# EAGLE design NixieClock_68k (EAGLE 9.2.1)

## Sheet 1 of 3: CPU, RAM, ROM
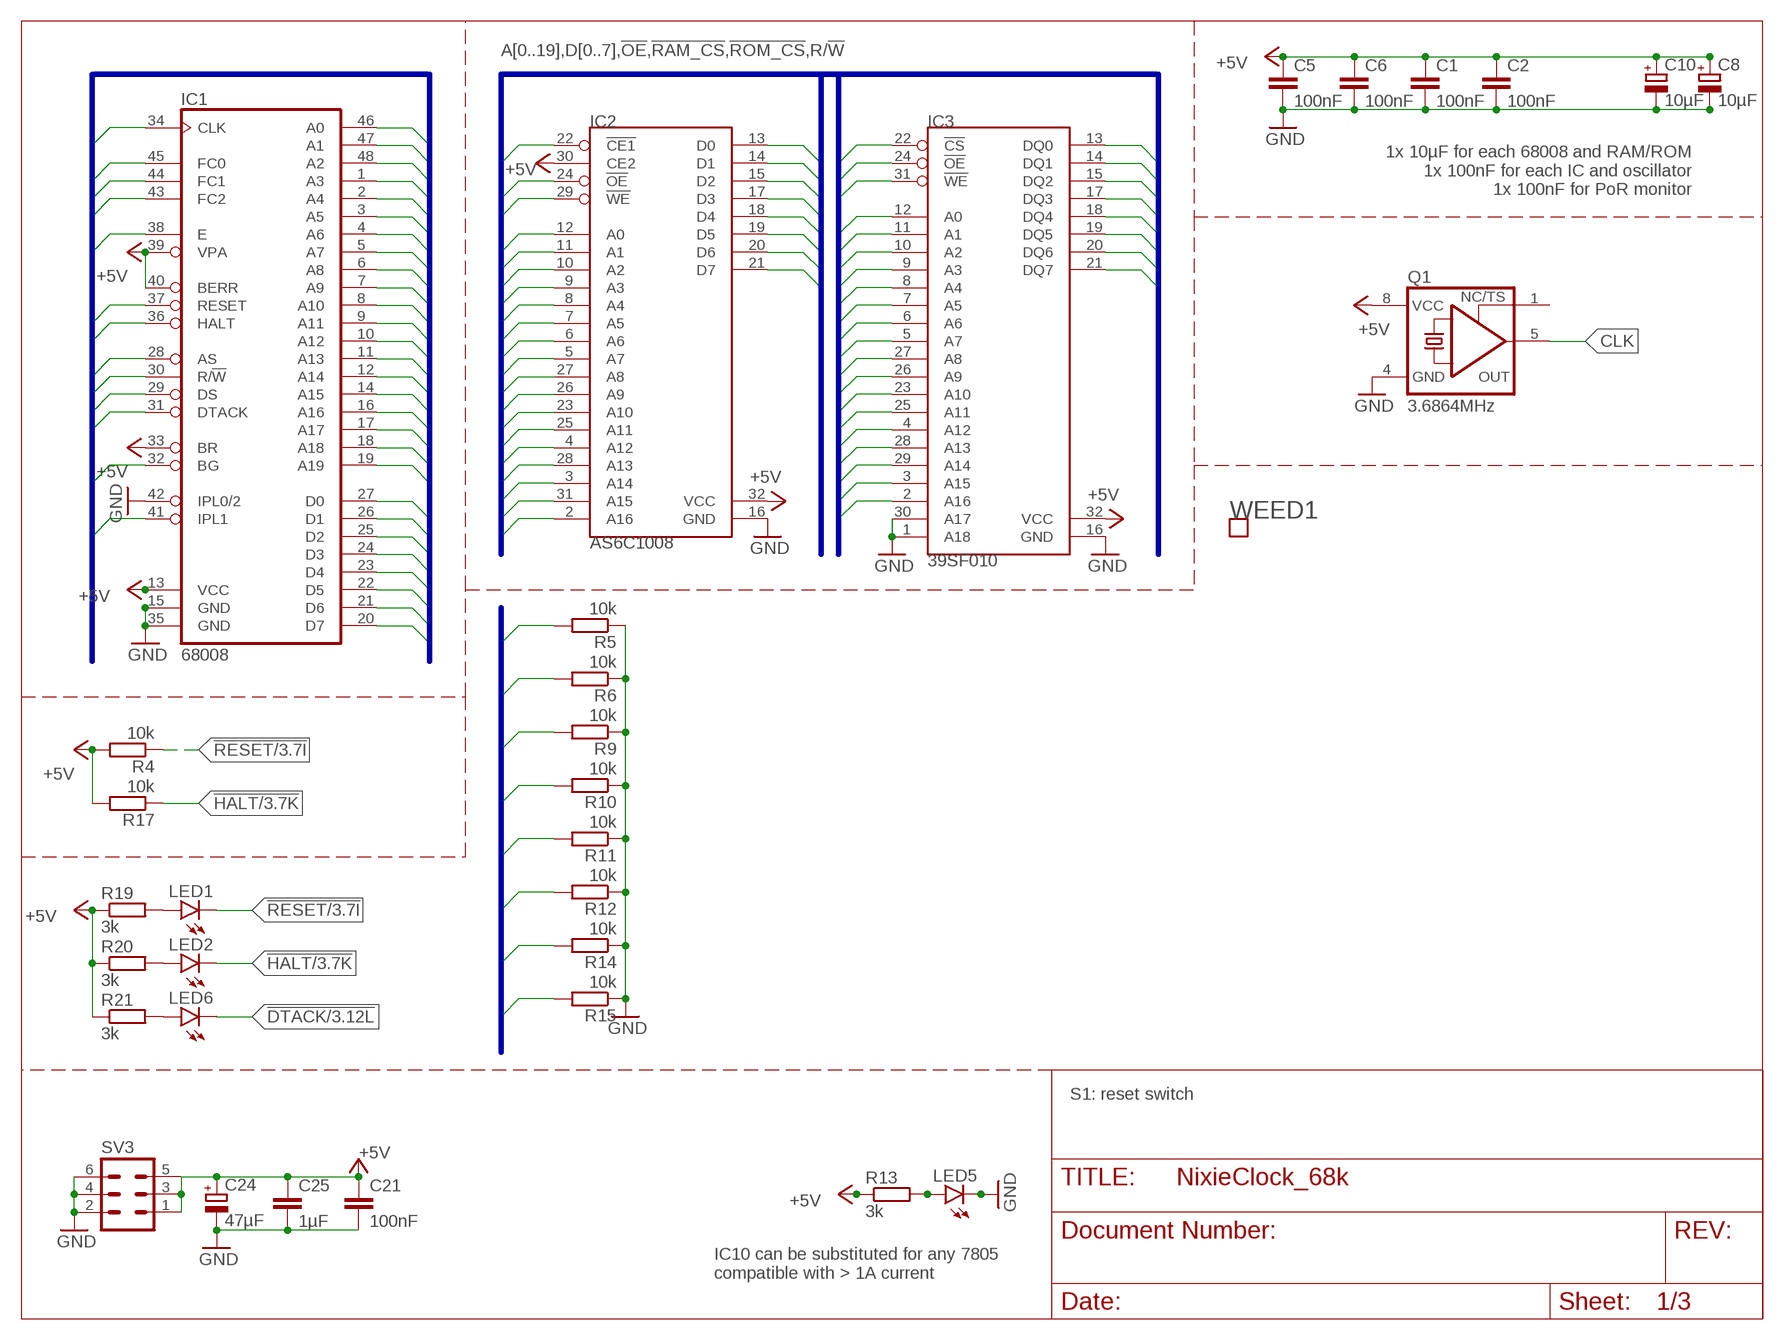
[diagram p0: schematic, sheet 1]

### Parts
C1  100nF  C-EUC0805  [C0805]
C2  100nF  C-EUC0805  [C0805]
C5  100nF  C-EUC0805  [C0805]
C6  100nF  C-EUC0805  [C0805]
C8  10µF  CPOL-EUSMCB  [SMC_B]
C10  10µF  CPOL-EUSMCB  [SMC_B]
C21  100nF  C-EUC0805  [C0805]
C24  47µF  CPOL-EUCT6032  [CT6032]
C25  1µF  C-EUC0805  [C0805]
IC1  68008  MC68008P  [DIL48]
IC2  AS6C1008  [DIL32]
IC3  39SF010  SST39SF0X0PDIP32  [DIL32]
LED1  LEDCHIPLED_1206  [CHIPLED_1206]
LED2  LEDCHIPLED_1206  [CHIPLED_1206]
LED5  LEDCHIPLED_1206  [CHIPLED_1206]
LED6  LEDCHIPLED_1206  [CHIPLED_1206]
Q1  3.6864MHz  XO-8  [DIL08S]
R4  10k  R-EU_R2012  [R2012]
R5  10k  R-EU_R2012  [R2012]
R6  10k  R-EU_R2012  [R2012]
R9  10k  R-EU_R2012  [R2012]
R10  10k  R-EU_R2012  [R2012]
R11  10k  R-EU_R2012  [R2012]
R12  10k  R-EU_R2012  [R2012]
R13  3k  R-EU_R2012  [R2012]
R14  10k  R-EU_R2012  [R2012]
R15  10k  R-EU_R2012  [R2012]
R17  10k  R-EU_R2012  [R2012]
R19  3k  R-EU_R2012  [R2012]
R20  3k  R-EU_R2012  [R2012]
R21  3k  R-EU_R2012  [R2012]
SV3  MA03-2  [MA03-2]
WEED1  WEED  [DOINK]

### Nets
!AS: IC1.28(AS) ; also sheet 3
!BG: IC1.32(BG)
!DS: IC1.29(DS)
!DTACK: IC1.31(DTACK) LED6.C ; also sheet 3
!HALT: IC1.36(HALT) LED2.C R17.1 ; also sheet 3
!IPL1: IC1.41(IPL1) ; also sheet 2
!OE: IC2.24(!OE) IC3.24(!OE) ; also sheet 2,3
!RAM_CS: IC2.22(!CE1) ; also sheet 3
!RESET: IC1.37(RESET) LED1.C R4.1 ; also sheet 2,3
!ROM_CS: IC3.22(!CS) ; also sheet 3
+5V: C1.1 C2.1 C5.1 C6.1 C8.+ C10.+ C21.1 C24.+ C25.1 IC1.13(VCC) IC1.33(BR) IC1.39(VPA) IC1.40(BERR) IC2.30(CE2) IC2.32(VCC) IC3.32(VCC) Q1.8(VCC) R4.2 R13.1 R17.2 R19.1 R20.1 R21.1 SV3.1 SV3.3 SV3.5 ; also sheet 2,3
A0: IC1.46(A0) IC2.12(A0) IC3.12(A0) ; also sheet 2
A1: IC1.47(A1) IC2.11(A1) IC3.11(A1) ; also sheet 2
A2: IC1.48(A2) IC2.10(A2) IC3.10(A2) ; also sheet 2
A3: IC1.1(A3) IC2.9(A3) IC3.9(A3) ; also sheet 2
A4: IC1.2(A4) IC2.8(A4) IC3.8(A4) ; also sheet 2
A5: IC1.3(A5) IC2.7(A5) IC3.7(A5) ; also sheet 2
A6: IC1.4(A6) IC2.6(A6) IC3.6(A6) ; also sheet 2
A7: IC1.5(A7) IC2.5(A7) IC3.5(A7) ; also sheet 2
A8: IC1.6(A8) IC2.27(A8) IC3.27(A8) ; also sheet 2
A9: IC1.7(A9) IC2.26(A9) IC3.26(A9) ; also sheet 2
A10: IC1.8(A10) IC2.23(A10) IC3.23(A10) ; also sheet 2
A11: IC1.9(A11) IC2.25(A11) IC3.25(A11) ; also sheet 2
A12: IC1.10(A12) IC2.4(A12) IC3.4(A12) ; also sheet 2
A13: IC1.11(A13) IC2.28(A13) IC3.28(A13) ; also sheet 2
A14: IC1.12(A14) IC2.3(A14) IC3.29(A14) ; also sheet 2
A15: IC1.14(A15) IC2.31(A15) IC3.3(A15)
A16: IC1.16(A16) IC2.2(A16) IC3.2(A16) ; also sheet 3
A17: IC1.17(A17) ; also sheet 3
A18: IC1.18(A18) ; also sheet 3
A19: IC1.19(A19)
CLK: IC1.34(CLK) Q1.5(OUT) ; also sheet 2
D0: IC1.27(D0) IC2.13(D0) IC3.13(DQ0) R5.2 ; also sheet 2
D1: IC1.26(D1) IC2.14(D1) IC3.14(DQ1) R6.2 ; also sheet 2
D2: IC1.25(D2) IC2.15(D2) IC3.15(DQ2) R9.2 ; also sheet 2
D3: IC1.24(D3) IC2.17(D3) IC3.17(DQ3) R10.2 ; also sheet 2
D4: IC1.23(D4) IC2.18(D4) IC3.18(DQ4) R11.2 ; also sheet 2
D5: IC1.22(D5) IC2.19(D5) IC3.19(DQ5) R12.2 ; also sheet 2
D6: IC1.21(D6) IC2.20(D6) IC3.20(DQ6) R14.2 ; also sheet 2
D7: IC1.20(D7) IC2.21(D7) IC3.21(DQ7) R15.2 ; also sheet 2
E: IC1.38(E)
FC0: IC1.45(FC0) ; also sheet 3
FC1: IC1.44(FC1) ; also sheet 3
FC2: IC1.43(FC2) ; also sheet 3
GND: C1.2 C2.2 C5.2 C6.2 C8.- C10.- C21.2 C24.- C25.2 IC1.15(GND) IC1.35(GND) IC1.42(IPL0/2) IC2.16(GND) IC3.1(A18) IC3.16(GND) IC3.30(A17) LED5.C Q1.4(GND) R5.1 R6.1 R9.1 R10.1 R11.1 R12.1 R14.1 R15.1 SV3.2 SV3.4 SV3.6 ; also sheet 2,3
N$2: LED1.A R19.2
N$4: LED5.A R13.2
N$6: LED2.A R20.2
N$10: LED6.A R21.2
R/!W!: IC1.30(R/!W) IC2.29(!WE) IC3.31(!WE) ; also sheet 2,3
Unconnected: Q1.1(TS)

### Buses
A[0..19],!AS,!BERR,!BG,!BR,CLK,D[0..7],!DS,!DTACK,E,FC[0..2],!HALT,!IPL0/2,!IPL1,!RESET,R/!W!,!VPA
A[0..19],D[0..7],!OE,!RAM_CS,!ROM_CS,R/!W!
D[0..7]

### Notes on the sheet
- 1x 10µF for each 68008 and RAM/ROM
  1x 100nF for each IC and oscillator
  1x 100nF for PoR monitor
- S1: reset switch
- IC10 can be substituted for any 7805 
  compatible with > 1A current

## Sheet 2 of 3: UART, RTC, Output Connectors
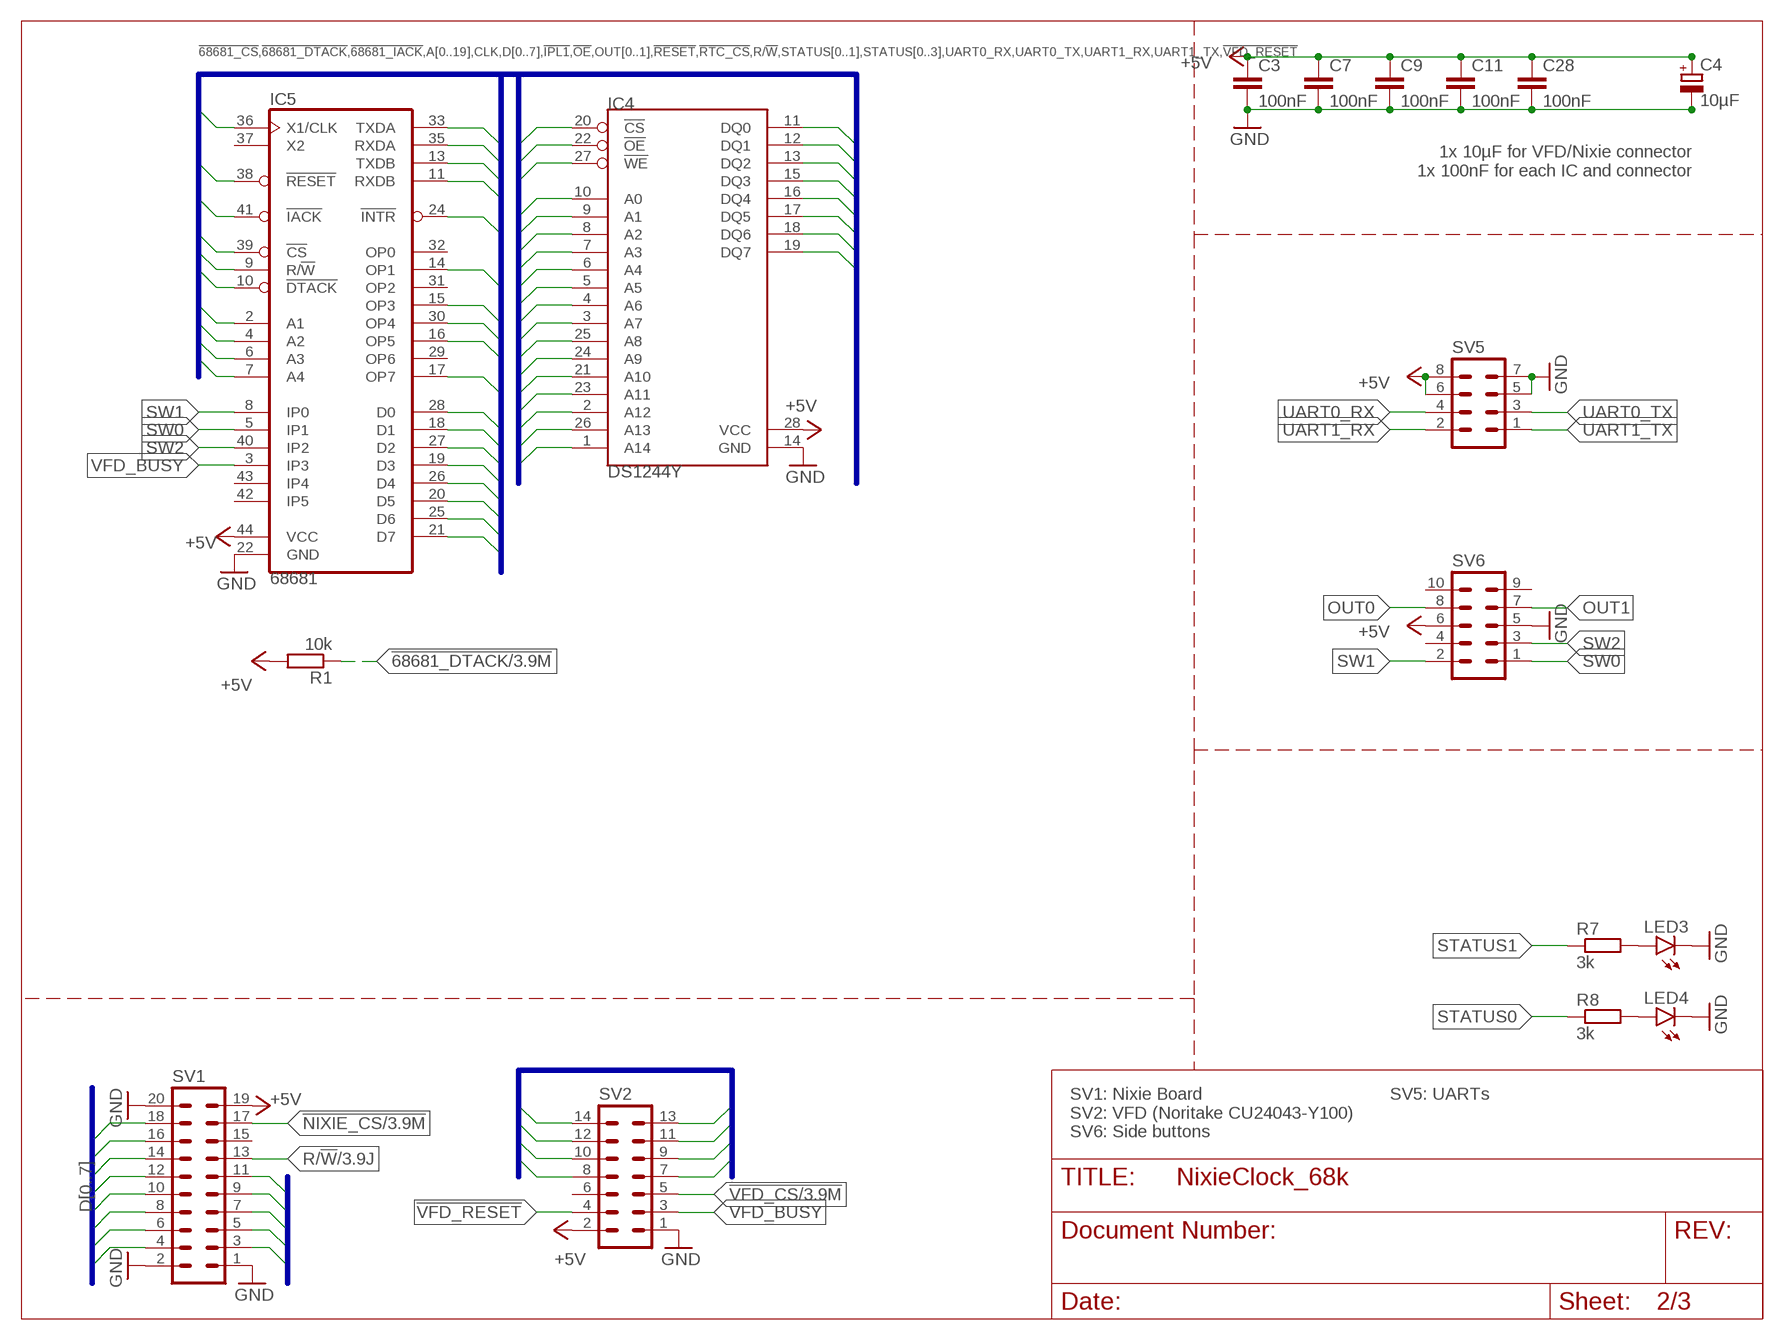
[diagram p1: schematic, sheet 2]

### Parts
C3  100nF  C-EUC0805  [C0805]
C4  10µF  CPOL-EUSMCB  [SMC_B]
C7  100nF  C-EUC0805  [C0805]
C9  100nF  C-EUC0805  [C0805]
C11  100nF  C-EUC0805  [C0805]
C28  100nF  C-EUC0805  [C0805]
IC4  DS1244Y  DS1244EDIP-28  [DIL28-6]
IC5  68681  MC68681PLCC44-SOCKET  [PLCC-S44]
LED3  LEDCHIPLED_1206  [CHIPLED_1206]
LED4  LEDCHIPLED_1206  [CHIPLED_1206]
R1  10k  R-EU_R2012  [R2012]
R7  3k  R-EU_R2012  [R2012]
R8  3k  R-EU_R2012  [R2012]
SV1  MA10-2  [MA10-2]
SV2  MA07-2  [MA07-2]
SV5  MA04-2  [MA04-2]
SV6  MA05-2  [MA05-2]

### Nets
!68681_CS: IC5.39(!CS) ; also sheet 3
!68681_DTACK: IC5.10(!DTACK) R1.1 ; also sheet 3
!68681_IACK: IC5.41(!IACK) ; also sheet 3
!IPL1: IC5.24(!INTR) ; also sheet 1
!NIXIE_CS: SV1.17 ; also sheet 3
!OE: IC4.22(!OE) ; also sheet 1,3
!RESET: IC5.38(!RESET) ; also sheet 1,3
!RTC_CS: IC4.20(!CS) ; also sheet 3
!VFD_CS: SV2.5 ; also sheet 3
!VFD_RESET: IC5.30(OP4) SV2.4
+5V: C3.1 C4.+ C7.1 C9.1 C11.1 C28.1 IC4.28(VCC) IC5.44(VCC) R1.2 SV1.19 SV2.2 SV5.6 SV5.8 SV6.6 ; also sheet 1,3
A0: IC4.10(A0) IC5.2(A1) SV1.3 ; also sheet 1
A1: IC4.9(A1) IC5.4(A2) SV1.5 ; also sheet 1
A2: IC4.8(A2) IC5.6(A3) SV1.7 ; also sheet 1
A3: IC4.7(A3) IC5.7(A4) SV1.9 ; also sheet 1
A4: IC4.6(A4) SV1.11 ; also sheet 1
A5: IC4.5(A5) ; also sheet 1
A6: IC4.4(A6) ; also sheet 1
A7: IC4.3(A7) ; also sheet 1
A8: IC4.25(A8) ; also sheet 1
A9: IC4.24(A9) ; also sheet 1
A10: IC4.21(A10) ; also sheet 1
A11: IC4.23(A11) ; also sheet 1
A12: IC4.2(A12) ; also sheet 1
A13: IC4.26(A13) ; also sheet 1
A14: IC4.1(A14) ; also sheet 1
CLK: IC5.36(X1/CLK) ; also sheet 1
D0: IC4.11(DQ0) IC5.28(D0) SV1.8 SV2.7 ; also sheet 1
D1: IC4.12(DQ1) IC5.18(D1) SV1.6 SV2.8 ; also sheet 1
D2: IC4.13(DQ2) IC5.27(D2) SV1.4 SV2.9 ; also sheet 1
D3: IC4.15(DQ3) IC5.19(D3) SV1.10 SV2.10 ; also sheet 1
D4: IC4.16(DQ4) IC5.26(D4) SV1.12 SV2.11 ; also sheet 1
D5: IC4.17(DQ5) IC5.20(D5) SV1.14 SV2.12 ; also sheet 1
D6: IC4.18(DQ6) IC5.25(D6) SV1.16 SV2.13 ; also sheet 1
D7: IC4.19(DQ7) IC5.21(D7) SV1.18 SV2.14 ; also sheet 1
GND: C3.2 C4.- C7.2 C9.2 C11.2 C28.2 IC4.14(GND) IC5.22(GND) LED3.C LED4.C SV1.1 SV1.2 SV1.20 SV2.1 SV5.5 SV5.7 SV6.5 ; also sheet 1,3
N$7: LED3.A R7.2
N$9: LED4.A R8.2
OUT0: IC5.15(OP3) SV6.8
OUT1: IC5.14(OP1) SV6.7
R/!W!: IC4.27(!WE) IC5.9(R/!W) SV1.13 ; also sheet 1,3
STATUS0: IC5.17(OP7) R8.1
STATUS1: IC5.16(OP5) R7.1
SW0: IC5.5(IP1) SV6.1
SW1: IC5.8(IP0) SV6.2
SW2: IC5.40(IP2) SV6.3
UART0_RX: IC5.35(RXDA) SV5.4
UART0_TX: IC5.33(TXDA) SV5.3
UART1_RX: IC5.11(RXDB) SV5.2
UART1_TX: IC5.13(TXDB) SV5.1
VFD_BUSY: IC5.3(IP3) SV2.3
Unconnected: IC5.29(OP6) IC5.31(OP2) IC5.32(OP0) IC5.37(X2) IC5.42(IP5) IC5.43(IP4) SV1.15 SV2.6 SV6.4 SV6.9 SV6.10

### Buses
!68681_CS,!68681_DTACK,!68681_IACK,A[0..19],CLK,D[0..7],!IPL1,!OE,OUT[0..1],!RESET,!RTC_CS,R/!W!,STATUS[0..1],STATUS[0..3],UART0_RX,UART0_TX,UART1_RX,UART1_TX,!VFD_RESET
D[0..7]
A[0..19]

### Notes on the sheet
- 1x 10µF for VFD/Nixie connector
  1x 100nF for each IC and connector
- SV1: Nixie Board
  SV2: VFD (Noritake CU24043-Y100)
  SV6: Side buttons
- SV5: UARTs

## Sheet 3 of 3: IRQs and Address Decoding
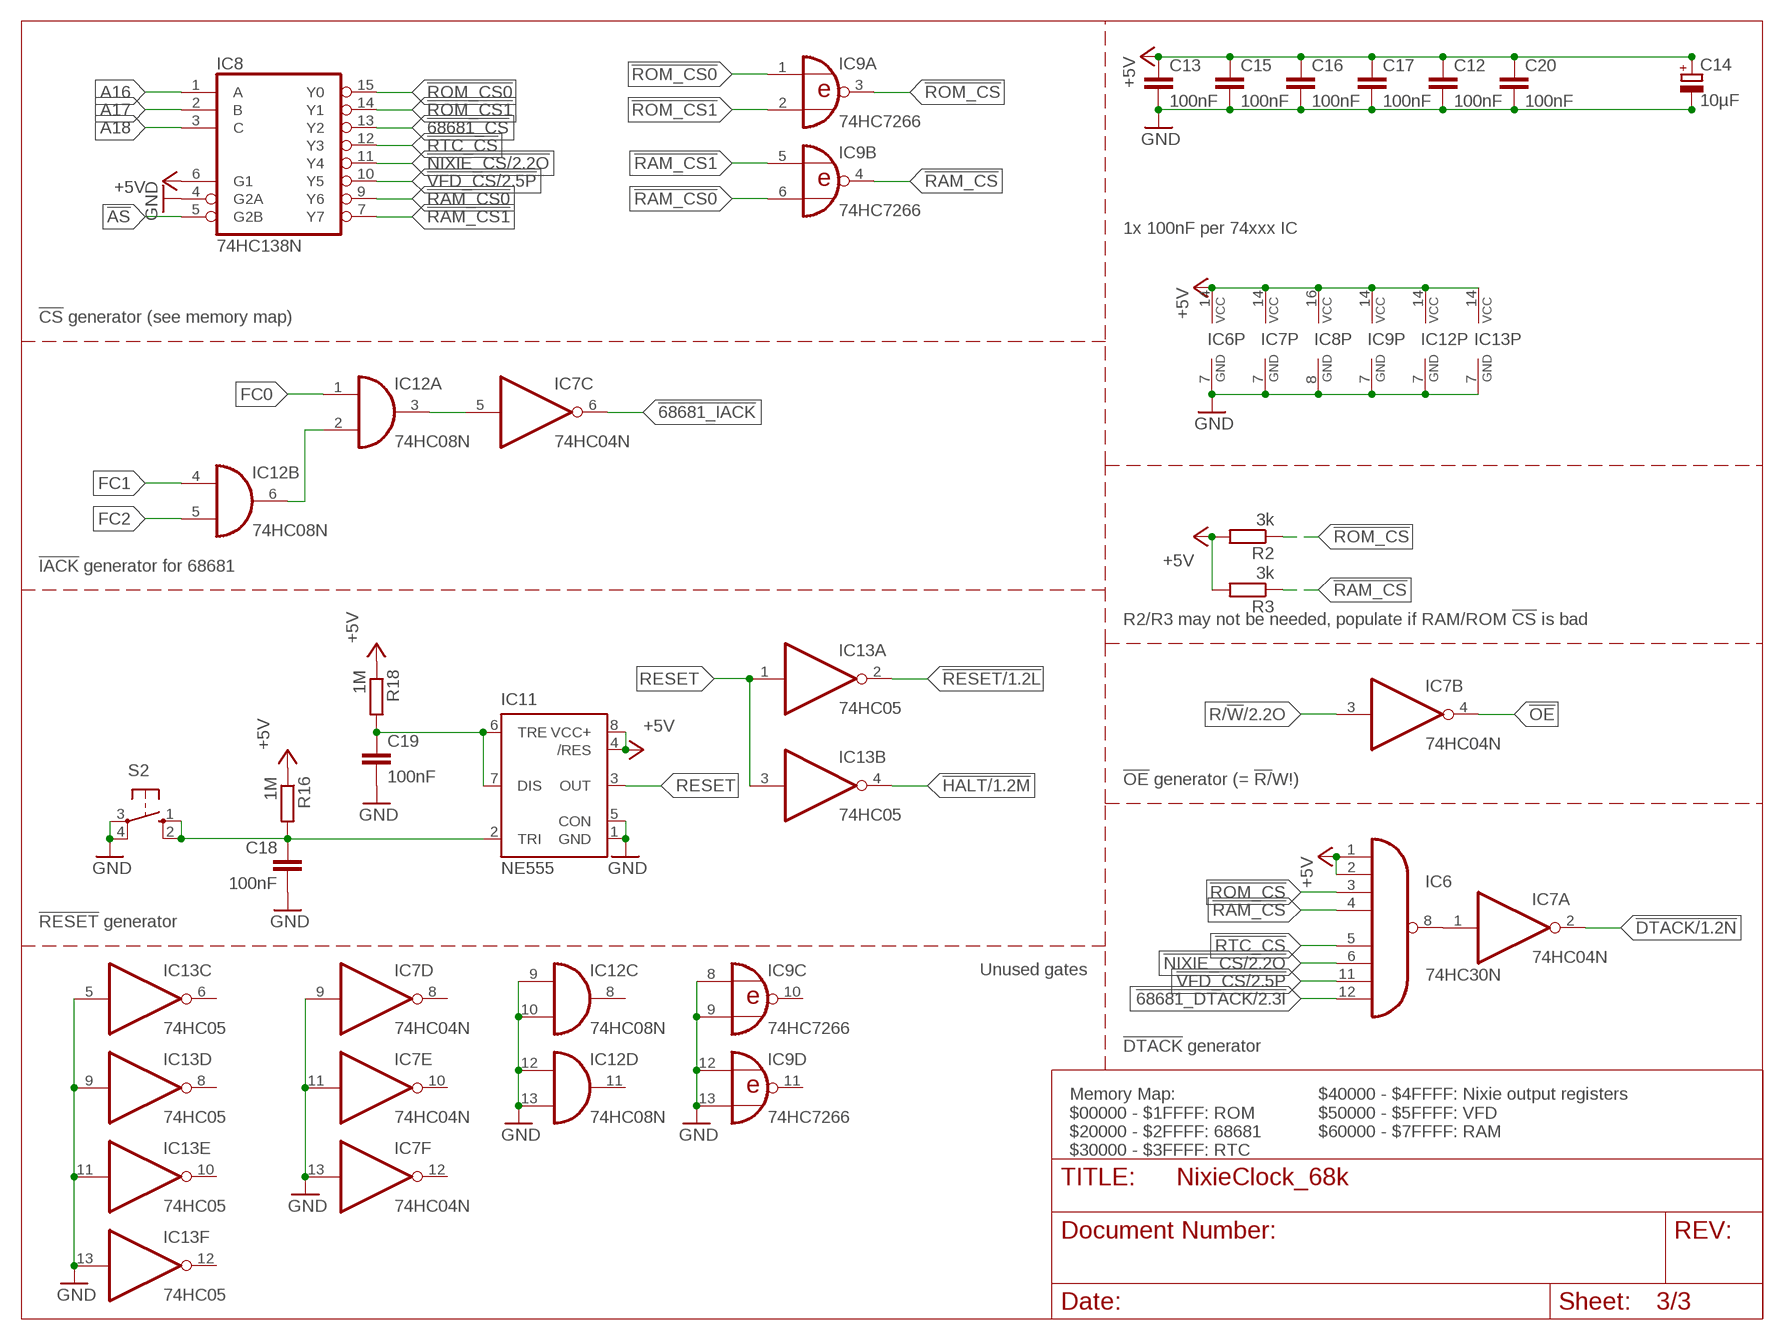
[diagram p2: schematic, sheet 3]

### Parts
C12  100nF  C-EUC0805  [C0805]
C13  100nF  C-EUC0805  [C0805]
C14  10µF  CPOL-EUSMCB  [SMC_B]
C15  100nF  C-EUC0805  [C0805]
C16  100nF  C-EUC0805  [C0805]
C17  100nF  C-EUC0805  [C0805]
C18  100nF  C-EUC0805  [C0805]
C19  100nF  C-EUC0805  [C0805]
C20  100nF  C-EUC0805  [C0805]
IC6  74HC30N  [DIL14]
IC7  74HC04N  [DIL14]
IC8  74HC138N  [DIL16]
IC9  74HC7266  74HC266N  [DIL14]
IC11  NE555  [DIL-08]
IC12  74HC08N  [DIL14]
IC13  74HC05  74HCT05N  [DIL14]
R2  3k  R-EU_R2012  [R2012]
R3  3k  R-EU_R2012  [R2012]
R16  1M  R-EU_R2012  [R2012]
R18  1M  R-EU_R2012  [R2012]
S2  10-XX  [B3F-10XX]

### Nets
!68681_CS: IC8.13(Y2) ; also sheet 2
!68681_DTACK: IC6.12(I7) ; also sheet 2
!68681_IACK: IC7.6(C:O) ; also sheet 2
!AS: IC8.5(G2B) ; also sheet 1
!DTACK: IC7.2(A:O) ; also sheet 1
!HALT: IC13.4(B:O) ; also sheet 1
!NIXIE_CS: IC6.6(I5) IC8.11(Y4) ; also sheet 2
!OE: IC7.4(B:O) ; also sheet 1,2
!RAM_CS: IC6.4(I3) IC9.4(B:O) R3.1 ; also sheet 1
!RAM_CS0: IC8.9(Y6) IC9.6(B:I1)
!RAM_CS1: IC8.7(Y7) IC9.5(B:I0)
!RESET: IC13.2(A:O) ; also sheet 1,2
!ROM_CS: IC6.3(I2) IC9.3(A:O) R2.1 ; also sheet 1
!ROM_CS0: IC8.15(Y0) IC9.1(A:I0)
!ROM_CS1: IC8.14(Y1) IC9.2(A:I1)
!RTC_CS: IC6.5(I4) IC8.12(Y3) ; also sheet 2
!VFD_CS: IC6.11(I6) IC8.10(Y5) ; also sheet 2
+5V: C12.1 C13.1 C14.+ C15.1 C16.1 C17.1 C20.1 IC6.1(I0) IC6.2(I1) IC6.14(VCC) IC7.14(P:VCC) IC8.6(G1) IC8.16(VCC) IC9.14(P:VCC) IC11.4(/RES) IC11.8(VCC+) IC12.14(P:VCC) IC13.14(P:VCC) R2.2 R3.2 R16.1 R18.1 ; also sheet 1,2
A16: IC8.1(A) ; also sheet 1
A17: IC8.2(B) ; also sheet 1
A18: IC8.3(C) ; also sheet 1
FC0: IC12.1(A:I0) ; also sheet 1
FC1: IC12.4(B:I0) ; also sheet 1
FC2: IC12.5(B:I1) ; also sheet 1
GND: C12.2 C13.2 C14.- C15.2 C16.2 C17.2 C18.2 C19.2 C20.2 IC6.7(GND) IC7.7(P:GND) IC7.9(D:I) IC7.11(E:I) IC7.13(F:I) IC8.4(G2A) IC8.8(GND) IC9.7(P:GND) IC9.8(C:I0) IC9.9(C:I1) IC9.12(D:I0) IC9.13(D:I1) IC11.1(GND) IC11.5(CON) IC12.7(P:GND) IC12.9(C:I0) IC12.10(C:I1) IC12.12(D:I0) IC12.13(D:I1) IC13.5(C:I) IC13.7(P:GND) IC13.9(D:I) IC13.11(E:I) IC13.13(F:I) S2.3(P) S2.4(P1) ; also sheet 1,2
N$1: C18.1 IC11.2(TRI) R16.2 S2.1(S) S2.2(S1)
N$3: IC6.8(O) IC7.1(A:I)
N$5: IC7.5(C:I) IC12.3(A:O)
N$11: IC12.2(A:I1) IC12.6(B:O)
N$12: C19.1 IC11.6(TRE) IC11.7(DIS) R18.2
R/!W!: IC7.3(B:I) ; also sheet 1,2
RESET: IC11.3(OUT) IC13.1(A:I) IC13.3(B:I)
Unconnected: IC7.8(D:O) IC7.10(E:O) IC7.12(F:O) IC9.10(C:O) IC9.11(D:O) IC12.8(C:O) IC12.11(D:O) IC13.6(C:O) IC13.8(D:O) IC13.10(E:O) IC13.12(F:O)

### Notes on the sheet
- 1x 100nF per 74xxx IC
- !CS! generator (see memory map)
- !IACK! generator for 68681
- R2/R3 may not be needed, populate if RAM/ROM !CS! is bad
- !OE! generator (= !R/!W!)
- !RESET! generator
- Unused gates
- !DTACK! generator
- Memory Map:
  $00000 - $1FFFF: ROM
  $20000 - $2FFFF: 68681
  $30000 - $3FFFF: RTC
- $40000 - $4FFFF: Nixie output registers
  $50000 - $5FFFF: VFD
  $60000 - $7FFFF: RAM

## Library data of the parts
C1-C3 C5-C7 C9 C11-C13 C15-C18 C20 C21 C28 = rcl:C-EU: CAPACITOR, European symbol; MOUSER: 710-885012207072; SPICEPREFIX: C
C4 C8 C10 C14 = rcl:CPOL-EU: POLARIZED CAPACITOR, European symbol; MOUSER: 581-TAJB106K020RNJV; SPICEPREFIX: C
C19 = rcl:C-EU: CAPACITOR, European symbol; MOUSER: 710-885012207078; SPICEPREFIX: C
C24 = rcl:CPOL-EU: POLARIZED CAPACITOR, European symbol; MOUSER: 581-TAJD476M016RNJV; SPICEPREFIX: C
C25 = rcl:C-EU: CAPACITOR, European symbol; MOUSER: 710-885012107015; SPICEPREFIX: C
IC1 = Parts:MC68008P: 68008 Processor (68000 with 8-bit bus)
IC2 = Parts:AS6C1008: AS6C1008 – 128K x 8 Low Power SRAM Datasheet <https://www.mouser.com/datasheet/2/12/AS6C1008feb2007-1511508.pdf>; MOUSER: 913-AS6C1008-55PCN
IC3 = Parts:SST39SF0X0: 1 Mbit / 2 Mbit / 4 Mbit Multi-Purpose Flash Datasheet <http://ww1.microchip.com/downloads/en/DeviceDoc/20005022C.pdf>; MOUSER: 804-39SF010A7CPHE
IC4 = Parts:DS1244: 256k NV SRAM with Phantom Clock Datasheet <https://datasheets.maximintegrated.com/en/ds/DS1244-DS1244P.pdf>; MOUSER: 700-DS1244Y-70
IC5 = Parts:MC68681: MC68681 Dual UART Datasheet <https://www.nxp.com/docs/en/data-sheet/SCC68681.pdf>
IC6 = 74xx-eu:74*30: 8-input NAND gate; MOUSER: 595-CD74HC30E
IC7 = 74xx-eu:74*04: Hex INVERTER; MOUSER: 595-SN74HC04AN
IC8 = 74xx-eu:74*138: 3-line to 8-line DECODER/DEMULTIPLEXER; MOUSER: 595-SN74HC138N
IC9 = 74xx-eu:74*266: Quadruple EXCLUSIVE-NOR (XNOR), open-collector; MOUSER: 595-CD74HC7266E
IC11 = st-microelectronics:NE555: General purpose bipolar Timer; MF: Arrow Electronics; MOUSER: 595-NE555P; MPN: NE555N; OC_FARNELL: 1467742; OC_NEWARK: 89K1486
IC12 = 74xx-eu:74*08: Quad 2-input AND gate; MOUSER: 595-SN74HC08AN
IC13 = 74xx-eu:74*05: Hex INVERTER, open collector; MOUSER: 595-SN74HC05N
LED1 LED2 = led:LED: LED OSRAM: - CHIPLED LG R971, LG N971, LY N971, LG Q971, LY Q971, LO R971, LY R971 LH N974, LH R974 LS Q976, LO Q976, LY Q976 LO Q996 - Hyper CHIPLED LW Q18S LB Q993, LB Q99A, LB R99A - SideLED LS A670, LO A670, LY A670, LG A670, LP A670 LB A673, LV A673, LT A673, LW A673 LH A674 LY A675 LS A676, LA A676, LO A676, LY A676, LW A676 LS A679, LY A679, LG A679 - Hyper Micro SIDELED® LS Y876, LA Y876, LO Y876, LY Y876 LT Y87S - SmartLED LW L88C, LW L88S LB L89C, LB L89S, LG L890 LS L89K, LO L89K, LY L89K LS L896, LA L896, LO L896, LY L896 - TOPLED LS T670, LO T670, LY T670, LG T670, LP T670 LSG T670, LSP T670, LSY T670, LOP T670, LYG T670 LG T671, LOG T671, LSG T671 LB T673, LV T673, LT T673, LW T673 LH T674 LS T676, LA T676, LO T676, LY T676, LB T676, LH T676, LSB T676, LW T676 LB T67C, LV T67C, LT T67C, LS T67K, LO T67K, LY T67K, LW E67C LS E67B, LA E67B, LO E67B, LY E67B, LB E67C, LV E67C, LT E67C LW T67C LS T679, LY T679, LG T679 LS T770, LO T770, LY T770, LG T770, LP T770 LB T773, LV T773, LT T773, LW T773 LH T774 LS E675, LA E675, LY E675, LS T675 LS T776, LA T776, LO T776, LY T776, LB T776 LHGB T686 LT T68C, LB T68C - Hyper Mini TOPLED® LB M676 - Mini TOPLED Santana® LG M470 LS M47K, LO M47K, LY M47K Source: http://www.osram.convergy.de LUXEON: - LUMILED® LXK2-PW12-R00, LXK2-PW12-S00, LXK2-PW14-U00, LXK2-PW14-V00 LXK2-PM12-R00, LXK2-PM12-S00, LXK2-PM14-U00 LXK2-PE12-Q00, LXK2-PE12-R00, LXK2-PE12-S00, LXK2-PE14-T00, LXK2-PE14-U00 LXK2-PB12-K00, LXK2-PB12-L00, LXK2-PB12-M00, LXK2-PB14-N00, LXK2-PB14-P00, LXK2-PB14-Q00 LXK2-PR12-L00, LXK2-PR12-M00, LXK2-PR14-Q00, LXK2-PR14-R00 LXK2-PD12-Q00, LXK2-PD12-R00, LXK2-PD12-S00 LXK2-PH12-R00, LXK2-PH12-S00 LXK2-PL12-P00, LXK2-PL12-Q00, LXK2-PL12-R00 Source: www.luxeon.com KINGBRIGHT: KA-3528ASYC Source: www.kingbright.com; MOUSER: 710-156120RS75300
LED3 LED4 LED6 = led:LED: LED OSRAM: - CHIPLED LG R971, LG N971, LY N971, LG Q971, LY Q971, LO R971, LY R971 LH N974, LH R974 LS Q976, LO Q976, LY Q976 LO Q996 - Hyper CHIPLED LW Q18S LB Q993, LB Q99A, LB R99A - SideLED LS A670, LO A670, LY A670, LG A670, LP A670 LB A673, LV A673, LT A673, LW A673 LH A674 LY A675 LS A676, LA A676, LO A676, LY A676, LW A676 LS A679, LY A679, LG A679 - Hyper Micro SIDELED® LS Y876, LA Y876, LO Y876, LY Y876 LT Y87S - SmartLED LW L88C, LW L88S LB L89C, LB L89S, LG L890 LS L89K, LO L89K, LY L89K LS L896, LA L896, LO L896, LY L896 - TOPLED LS T670, LO T670, LY T670, LG T670, LP T670 LSG T670, LSP T670, LSY T670, LOP T670, LYG T670 LG T671, LOG T671, LSG T671 LB T673, LV T673, LT T673, LW T673 LH T674 LS T676, LA T676, LO T676, LY T676, LB T676, LH T676, LSB T676, LW T676 LB T67C, LV T67C, LT T67C, LS T67K, LO T67K, LY T67K, LW E67C LS E67B, LA E67B, LO E67B, LY E67B, LB E67C, LV E67C, LT E67C LW T67C LS T679, LY T679, LG T679 LS T770, LO T770, LY T770, LG T770, LP T770 LB T773, LV T773, LT T773, LW T773 LH T774 LS E675, LA E675, LY E675, LS T675 LS T776, LA T776, LO T776, LY T776, LB T776 LHGB T686 LT T68C, LB T68C - Hyper Mini TOPLED® LB M676 - Mini TOPLED Santana® LG M470 LS M47K, LO M47K, LY M47K Source: http://www.osram.convergy.de LUXEON: - LUMILED® LXK2-PW12-R00, LXK2-PW12-S00, LXK2-PW14-U00, LXK2-PW14-V00 LXK2-PM12-R00, LXK2-PM12-S00, LXK2-PM14-U00 LXK2-PE12-Q00, LXK2-PE12-R00, LXK2-PE12-S00, LXK2-PE14-T00, LXK2-PE14-U00 LXK2-PB12-K00, LXK2-PB12-L00, LXK2-PB12-M00, LXK2-PB14-N00, LXK2-PB14-P00, LXK2-PB14-Q00 LXK2-PR12-L00, LXK2-PR12-M00, LXK2-PR14-Q00, LXK2-PR14-R00 LXK2-PD12-Q00, LXK2-PD12-R00, LXK2-PD12-S00 LXK2-PH12-R00, LXK2-PH12-S00 LXK2-PL12-P00, LXK2-PL12-Q00, LXK2-PL12-R00 Source: www.luxeon.com KINGBRIGHT: KA-3528ASYC Source: www.kingbright.com; MOUSER: 710-156120VS75300
LED5 = led:LED: LED OSRAM: - CHIPLED LG R971, LG N971, LY N971, LG Q971, LY Q971, LO R971, LY R971 LH N974, LH R974 LS Q976, LO Q976, LY Q976 LO Q996 - Hyper CHIPLED LW Q18S LB Q993, LB Q99A, LB R99A - SideLED LS A670, LO A670, LY A670, LG A670, LP A670 LB A673, LV A673, LT A673, LW A673 LH A674 LY A675 LS A676, LA A676, LO A676, LY A676, LW A676 LS A679, LY A679, LG A679 - Hyper Micro SIDELED® LS Y876, LA Y876, LO Y876, LY Y876 LT Y87S - SmartLED LW L88C, LW L88S LB L89C, LB L89S, LG L890 LS L89K, LO L89K, LY L89K LS L896, LA L896, LO L896, LY L896 - TOPLED LS T670, LO T670, LY T670, LG T670, LP T670 LSG T670, LSP T670, LSY T670, LOP T670, LYG T670 LG T671, LOG T671, LSG T671 LB T673, LV T673, LT T673, LW T673 LH T674 LS T676, LA T676, LO T676, LY T676, LB T676, LH T676, LSB T676, LW T676 LB T67C, LV T67C, LT T67C, LS T67K, LO T67K, LY T67K, LW E67C LS E67B, LA E67B, LO E67B, LY E67B, LB E67C, LV E67C, LT E67C LW T67C LS T679, LY T679, LG T679 LS T770, LO T770, LY T770, LG T770, LP T770 LB T773, LV T773, LT T773, LW T773 LH T774 LS E675, LA E675, LY E675, LS T675 LS T776, LA T776, LO T776, LY T776, LB T776 LHGB T686 LT T68C, LB T68C - Hyper Mini TOPLED® LB M676 - Mini TOPLED Santana® LG M470 LS M47K, LO M47K, LY M47K Source: http://www.osram.convergy.de LUXEON: - LUMILED® LXK2-PW12-R00, LXK2-PW12-S00, LXK2-PW14-U00, LXK2-PW14-V00 LXK2-PM12-R00, LXK2-PM12-S00, LXK2-PM14-U00 LXK2-PE12-Q00, LXK2-PE12-R00, LXK2-PE12-S00, LXK2-PE14-T00, LXK2-PE14-U00 LXK2-PB12-K00, LXK2-PB12-L00, LXK2-PB12-M00, LXK2-PB14-N00, LXK2-PB14-P00, LXK2-PB14-Q00 LXK2-PR12-L00, LXK2-PR12-M00, LXK2-PR14-Q00, LXK2-PR14-R00 LXK2-PD12-Q00, LXK2-PD12-R00, LXK2-PD12-S00 LXK2-PH12-R00, LXK2-PH12-S00 LXK2-PL12-P00, LXK2-PL12-Q00, LXK2-PL12-R00 Source: www.luxeon.com KINGBRIGHT: KA-3528ASYC Source: www.kingbright.com; MOUSER: 710-156120YS75300
Q1 = crystal:XO-: CRYSTAL; MOUSER: 774-MXO45HS-3C-3.6; OC_FARNELL: unknown; OC_NEWARK: unknown
R1 R4-R6 R9-R12 R14 R15 R17 = rcl:R-EU_: RESISTOR, European symbol; MOUSER: 652-CR0805FX-1002ELF; SPICEPREFIX: R
R2 R3 R7 R8 R13 R19-R21 = rcl:R-EU_: RESISTOR, European symbol; MOUSER: 652-CR0805JW-302ELF; SPICEPREFIX: R
R16 R18 = rcl:R-EU_: RESISTOR, European symbol; MOUSER: 652-CR0805FX-18R2ELF; SPICEPREFIX: R
S2 = switch-omron:10-XX: OMRON SWITCH; MOUSER: 653-B3F-1052; MPN: B3F-1000; OC_FARNELL: 176432; OC_NEWARK: 36M3542
SV1 = con-lstb:MA10-2: PIN HEADER; OC_FARNELL: unknown; OC_NEWARK: unknown
SV2 = con-lstb:MA07-2: PIN HEADER; OC_FARNELL: unknown; OC_NEWARK: unknown
SV3 = con-lstb:MA03-2: PIN HEADER; OC_FARNELL: unknown; OC_NEWARK: unknown
SV5 = con-lstb:MA04-2: PIN HEADER; OC_FARNELL: unknown; OC_NEWARK: unknown
SV6 = con-lstb:MA05-2: PIN HEADER; OC_FARNELL: unknown; OC_NEWARK: unknown
WEED1 = Parts:WEED

## Net classes
0 default: width 0.203 mm

## Board
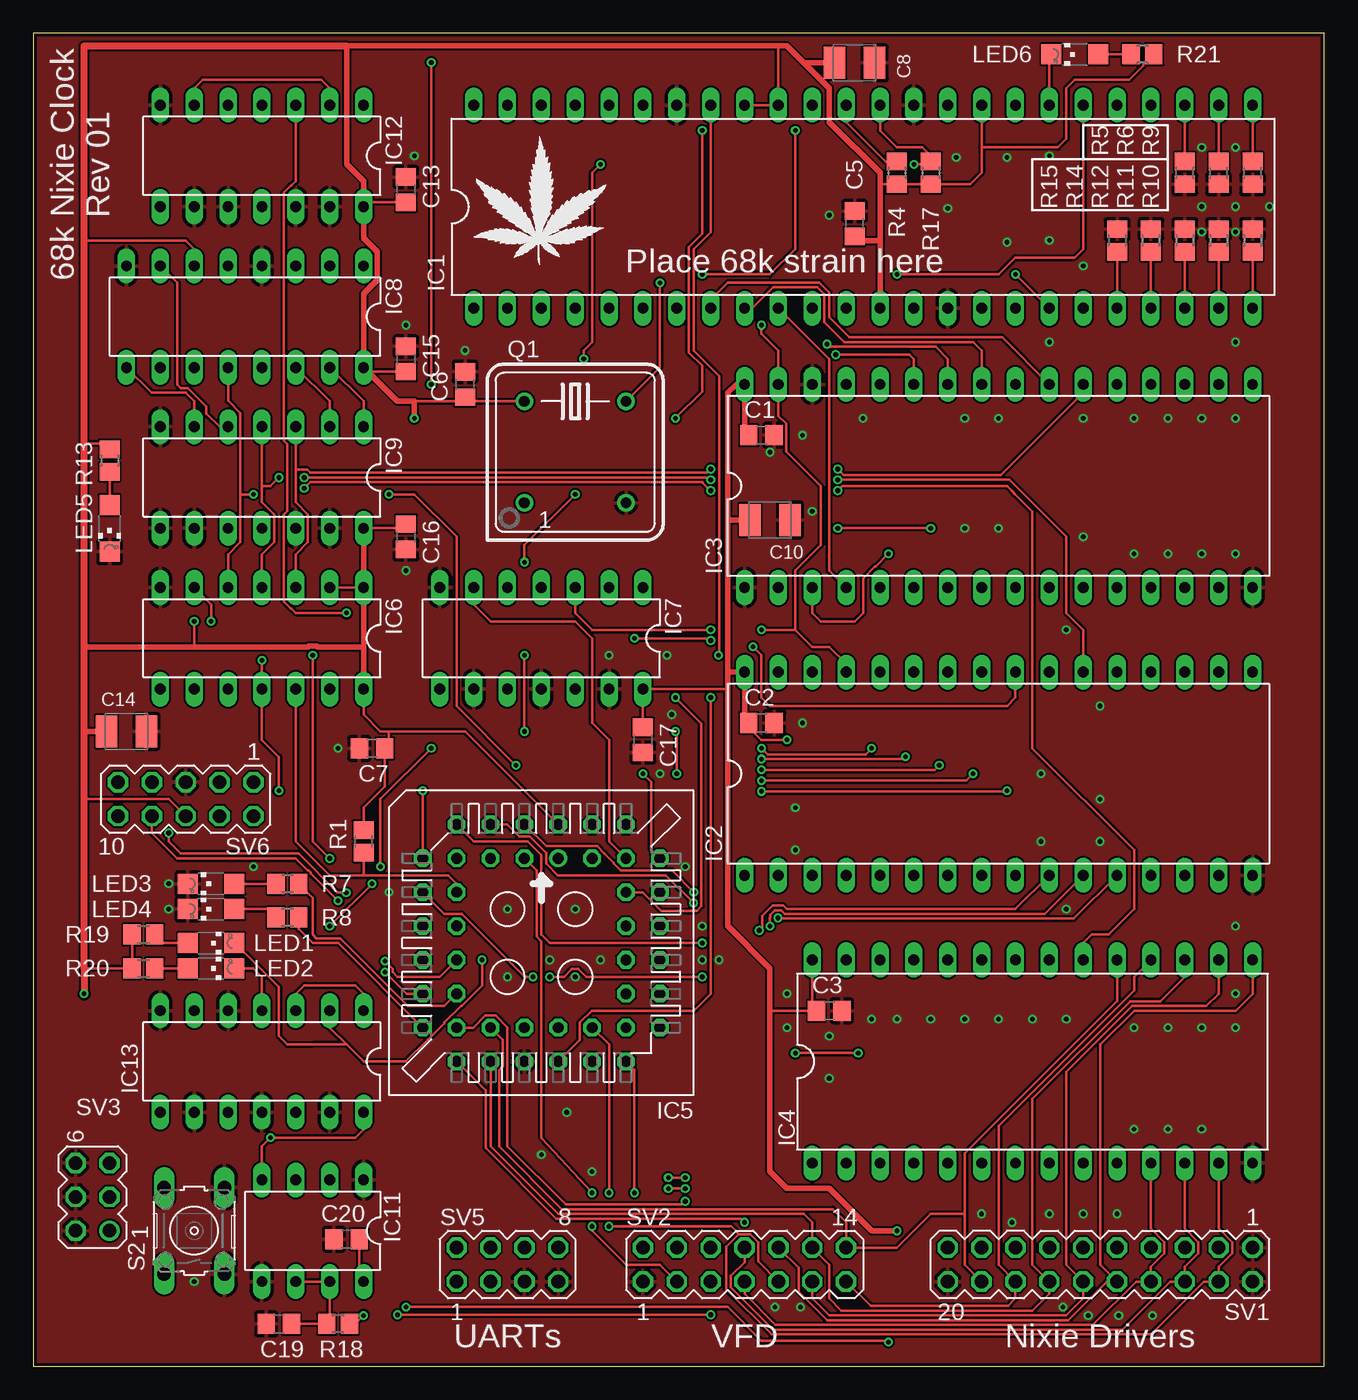
[diagram p3: board, top side]
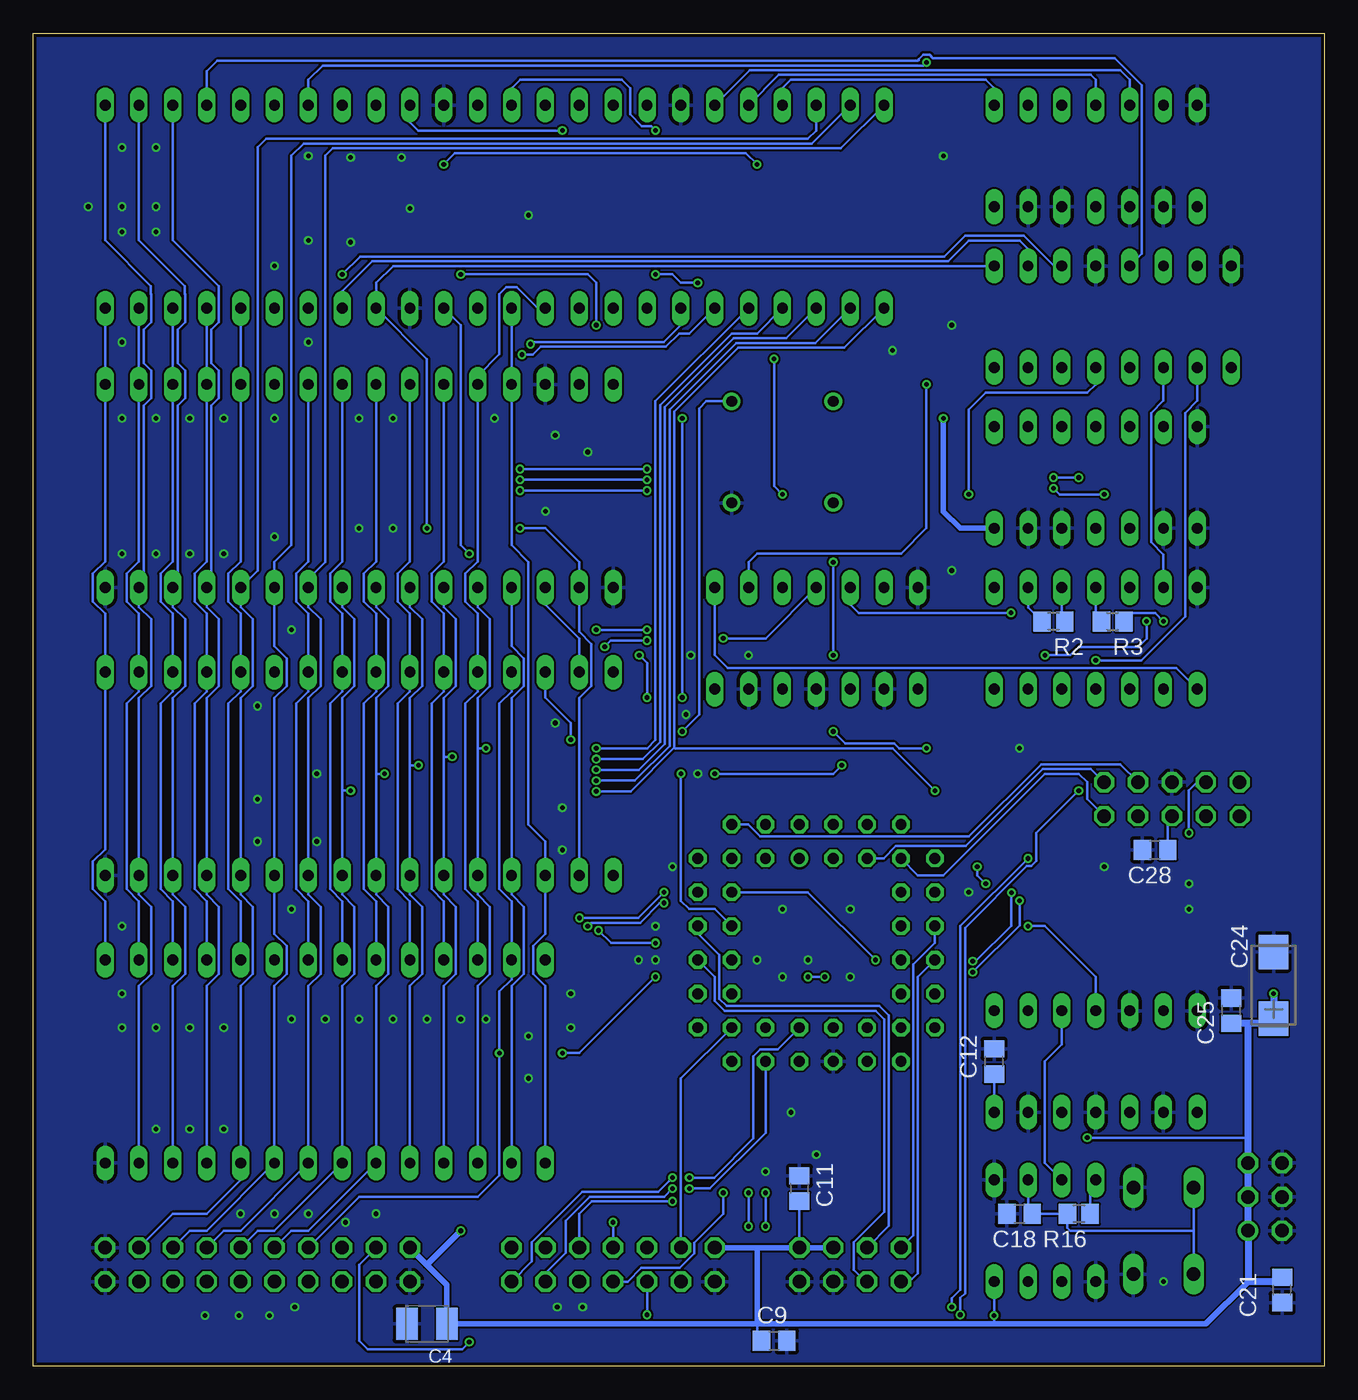
[diagram p4: board, bottom side, seen from below]

Size 96.83 x 100 mm. Coordinates in mm from the lower left corner, seen from the top.
Outline: 0,0 96.83,0 96.83,100 0,100 0,0
Copper layers (1*16): Top 0.035mm / dielectric 1.5mm / Bottom 0.035mm
Design rules "dirt_cheap_dirty_boards.v1.1": minimum track width 6mil, minimum drill 12mil, track to track 6mil, track to pad 6mil, pad to pad 6mil, via to via 6mil, smd to smd 0mil, copper to edge 10mil, drill to drill 10mil, minimum pad ring 10mil, minimum via ring 6mil, stop-mask expansion 2mil, vias tented up to drill 25mil, thermal gap 10mil

### Footprints (pad centres in the part's own frame; a part is rotated, then mirrored left to right if it is on the bottom)
C0805 = smd 1.3 x 1.5: 1 -0.95,0; 2 0.95,0
SMC_B = smd 1.6 x 2.4: + -1.5,0; - 1.5,0
CT6032 = smd 2.6 x 2.2: + -2.5,0; - 2.5,0
DIL48 = drill 0.813 long: 1 -29.21,-7.62; 2 -26.67,-7.62; 3 -24.13,-7.62; 4 -21.59,-7.62; 5 -19.05,-7.62; 6 -16.51,-7.62; 7 -13.97,-7.62; 8 -11.43,-7.62; 9 -8.89,-7.62; 10 -6.35,-7.62; 11 -3.81,-7.62; 12 -1.27,-7.62; 13 1.27,-7.62; 14 3.81,-7.62; 15 6.35,-7.62; 16 8.89,-7.62; 17 11.43,-7.62; 18 13.97,-7.62; 19 16.51,-7.62; 20 19.05,-7.62; 21 21.59,-7.62; 22 24.13,-7.62; 23 26.67,-7.62; 24 29.21,-7.62; 25 29.21,7.62; 26 26.67,7.62; 27 24.13,7.62; 28 21.59,7.62; 29 19.05,7.62; 30 16.51,7.62; 31 13.97,7.62; 32 11.43,7.62; 33 8.89,7.62; 34 6.35,7.62; 35 3.81,7.62; 36 1.27,7.62; 37 -1.27,7.62; 38 -3.81,7.62; 39 -6.35,7.62; 40 -8.89,7.62; 41 -11.43,7.62; 42 -13.97,7.62; 43 -16.51,7.62; 44 -19.05,7.62; 45 -21.59,7.62; 46 -24.13,7.62; 47 -26.67,7.62; 48 -29.21,7.62
DIL32 = drill 0.813 long: 1 -19.05,-7.62; 2 -16.51,-7.62; 3 -13.97,-7.62; 4 -11.43,-7.62; 5 -8.89,-7.62; 6 -6.35,-7.62; 7 -3.81,-7.62; 8 -1.27,-7.62; 9 1.27,-7.62; 10 3.81,-7.62; 11 6.35,-7.62; 12 8.89,-7.62; 13 11.43,-7.62; 14 13.97,-7.62; 15 16.51,-7.62; 16 19.05,-7.62; 17 19.05,7.62; 18 16.51,7.62; 19 13.97,7.62; 20 11.43,7.62; 21 8.89,7.62; 22 6.35,7.62; 23 3.81,7.62; 24 1.27,7.62; 25 -1.27,7.62; 26 -3.81,7.62; 27 -6.35,7.62; 28 -8.89,7.62; 29 -11.43,7.62; 30 -13.97,7.62; 31 -16.51,7.62; 32 -19.05,7.62
DIL28-6 = drill 0.813 long: 1 -16.51,-7.62; 2 -13.97,-7.62; 3 -11.43,-7.62; 4 -8.89,-7.62; 5 -6.35,-7.62; 6 -3.81,-7.62; 7 -1.27,-7.62; 8 1.27,-7.62; 9 3.81,-7.62; 10 6.35,-7.62; 11 8.89,-7.62; 12 11.43,-7.62; 13 13.97,-7.62; 14 16.51,-7.62; 15 16.51,7.62; 16 13.97,7.62; 17 11.43,7.62; 18 8.89,7.62; 19 6.35,7.62; 20 3.81,7.62; 21 1.27,7.62; 22 -1.27,7.62; 23 -3.81,7.62; 24 -6.35,7.62; 25 -8.89,7.62; 26 -11.43,7.62; 27 -13.97,7.62; 28 -16.51,7.62
PLCC-S44 = drill 0.813: 1 1.27,6.35 | drill 0.813 octagon: 2 -1.27,8.89; 3 -1.27,6.35; 4 -3.81,8.89; 5 -3.81,6.35; 6 -6.35,8.89; 7 -8.89,6.35; 8 -6.35,6.35; 9 -8.89,3.81; 10 -6.35,3.81; 11 -8.89,1.27; 12 -6.35,1.27; 13 -8.89,-1.27; 14 -6.35,-1.27; 15 -8.89,-3.81; 16 -6.35,-3.81; 17 -8.89,-6.35; 18 -6.35,-8.89; 19 -6.35,-6.35; 20 -3.81,-8.89; 21 -3.81,-6.35; 22 -1.27,-8.89; 23 -1.27,-6.35; 24 1.27,-8.89; 25 1.27,-6.35; 26 3.81,-8.89; 27 3.81,-6.35; 28 6.35,-8.89; 29 8.89,-6.35; 30 6.35,-6.35; 31 8.89,-3.81; 32 6.35,-3.81; 33 8.89,-1.27; 34 6.35,-1.27; 35 8.89,1.27; 36 6.35,1.27; 37 8.89,3.81; 38 6.35,3.81; 39 8.89,6.35; 40 6.35,8.89; 41 6.35,6.35; 42 3.81,8.89; 43 3.81,6.35; 44 1.27,8.89
DIL14 = drill 0.813 long: 1 -7.62,-3.81; 2 -5.08,-3.81; 3 -2.54,-3.81; 4 0,-3.81; 5 2.54,-3.81; 6 5.08,-3.81; 7 7.62,-3.81; 8 7.62,3.81; 9 5.08,3.81; 10 2.54,3.81; 11 0,3.81; 12 -2.54,3.81; 13 -5.08,3.81; 14 -7.62,3.81
DIL16 = drill 0.813 long: 1 -8.89,-3.81; 2 -6.35,-3.81; 3 -3.81,-3.81; 4 -1.27,-3.81; 5 1.27,-3.81; 6 3.81,-3.81; 7 6.35,-3.81; 8 8.89,-3.81; 9 8.89,3.81; 10 6.35,3.81; 11 3.81,3.81; 12 1.27,3.81; 13 -1.27,3.81; 14 -3.81,3.81; 15 -6.35,3.81; 16 -8.89,3.81
DIL-08 = drill 0.813 long: 1 -3.81,-3.81; 2 -1.27,-3.81; 3 1.27,-3.81; 4 3.81,-3.81; 5 3.81,3.81; 6 1.27,3.81; 7 -1.27,3.81; 8 -3.81,3.81
CHIPLED_1206 = smd 1.5 x 1.5: A 0,-1.75; C 0,1.75
DIL08S = drill 0.813: 1 -3.81,-3.81; 4 3.81,-3.81; 5 3.81,3.81; 8 -3.81,3.81
R2012 = smd 1.3 x 1.5: 1 -0.85,0; 2 0.85,0
B3F-10XX = drill 1.016 long: 1 -3.251,2.261; 2 3.251,2.261; 3 -3.251,-2.261; 4 3.251,-2.261
MA10-2 = drill 1.016 octagon: 1 -11.43,-1.27; 2 -11.43,1.27; 3 -8.89,-1.27; 4 -8.89,1.27; 5 -6.35,-1.27; 6 -6.35,1.27; 7 -3.81,-1.27; 8 -3.81,1.27; 9 -1.27,-1.27; 10 -1.27,1.27; 11 1.27,-1.27; 12 1.27,1.27; 13 3.81,-1.27; 14 3.81,1.27; 15 6.35,-1.27; 16 6.35,1.27; 17 8.89,-1.27; 18 8.89,1.27; 19 11.43,-1.27; 20 11.43,1.27
MA07-2 = drill 1.016 octagon: 1 -7.62,-1.27; 2 -7.62,1.27; 3 -5.08,-1.27; 4 -5.08,1.27; 5 -2.54,-1.27; 6 -2.54,1.27; 7 0,-1.27; 8 0,1.27; 9 2.54,-1.27; 10 2.54,1.27; 11 5.08,-1.27; 12 5.08,1.27; 13 7.62,-1.27; 14 7.62,1.27
MA03-2 = drill 1.016: 1 -2.54,-1.27 | drill 1.016 octagon: 2 -2.54,1.27; 3 0,-1.27; 4 0,1.27; 5 2.54,-1.27; 6 2.54,1.27
MA04-2 = drill 1.016 octagon: 1 -3.81,-1.27; 2 -3.81,1.27; 3 -1.27,-1.27; 4 -1.27,1.27; 5 1.27,-1.27; 6 1.27,1.27; 7 3.81,-1.27; 8 3.81,1.27
MA05-2 = drill 1.016 octagon: 1 -5.08,-1.27; 2 -5.08,1.27; 3 -2.54,-1.27; 4 -2.54,1.27; 5 0,-1.27; 6 0,1.27; 7 2.54,-1.27; 8 2.54,1.27; 9 5.08,-1.27; 10 5.08,1.27

### Placement (x,y rotation side)
C1  54.61,69.85 0 top
C2  54.61,48.26 0 top
C3  59.69,26.67 0 top
C4  67.31,3.17 180 bottom
C5  61.59,85.72 90 top
C6  32.38,73.66 90 top
C7  25.4,46.35 180 top
C8  61.59,97.79 0 top
C9  41.27,1.91 0 bottom
C10  55.24,63.5 0 top
C11  39.37,13.34 90 bottom
C12  24.77,22.86 90 bottom
C13  27.94,88.27 90 top
C14  6.99,47.62 0 top
C15  27.94,75.56 90 top
C16  27.94,62.23 270 top
C17  45.72,46.99 270 top
C18  22.86,11.43 180 bottom
C19  18.41,3.17 180 top
C20  23.5,9.53 180 top
C21  3.17,5.71 270 bottom
C24  3.81,28.57 90 bottom
C25  6.99,26.67 90 bottom
C28  12.7,38.73 180 bottom
IC1  62.23,87 0 top
IC2  72.39,44.45 0 top
IC3  72.39,66.04 0 top
IC4  74.93,22.86 0 top
IC5  38.1,31.75 0 top
IC6  17.14,54.61 180 top
IC7  38.1,54.61 180 top
IC8  15.88,78.74 180 top
IC9  17.14,66.67 180 top
IC11  20.95,10.16 180 top
IC12  17.14,90.81 180 top
IC13  17.14,22.86 180 top
LED1  13.34,31.75 270 top
LED2  13.34,29.84 270 top
LED3  13.34,36.2 90 top
LED4  13.34,34.29 90 top
LED5  5.71,62.87 180 top
LED6  78.11,98.42 90 top
Q1  40.64,68.58 0 top
R1  24.77,39.37 90 top
R2  20.32,55.88 180 bottom
R3  15.88,55.88 0 bottom
R4  64.77,89.53 270 top
R5  86.36,89.53 90 top
R6  88.9,89.53 90 top
R7  19.05,36.2 180 top
R8  19.05,33.66 180 top
R9  91.44,89.53 90 top
R10  91.44,84.45 270 top
R11  88.9,84.45 270 top
R12  86.36,84.45 270 top
R13  5.71,67.94 270 top
R14  83.82,84.45 270 top
R15  81.28,84.45 270 top
R16  18.41,11.43 180 bottom
R17  67.31,89.53 270 top
R18  22.86,3.17 180 top
R19  8.26,32.38 0 top
R20  8.26,29.84 0 top
R21  83.19,98.42 180 top
S2  12.06,10.16 90 top
SV1  80.01,7.62 180 top
SV2  53.34,7.62 0 top
SV3  4.45,12.7 90 top
SV5  35.56,7.62 0 top
SV6  11.43,42.55 180 top
WEED1  33.02,82.55 0 top

### Tracks (layer width: path | path; a pad name or v marks a point on that pad's centre or on a via)
!68681_CS  (via drill 0.35)
  Top 0.203: IC5.39 46.35,38.73 46.35,43.81 v45.72,44.45 | v26.67,65.41 28.57,65.41 31.75,62.23 31.75,49.53 v36.2,45.09
  Bottom 0.203: v45.72,44.45 36.83,44.45 v36.2,45.09 | v26.67,65.41 26.67,71.75 25.4,73.03 17.78,73.03 17.14,73.66 IC8.13
!68681_DTACK
  Top 0.203: IC6.12 19.68,39.37 22.23,36.83 24.77,36.83 | 24.77,36.83 31.11,36.83 31.75,36.2 IC5.10 | R1.1 24.77,36.83
!68681_IACK
  Top 0.203: IC5.41 43.18,39.37 43.18,46.99 41.91,48.26 41.91,54.61 40.64,55.88 34.29,55.88 33.02,57.15 IC7.6
!AS
  Bottom 0.203: IC1.28 83.82,97.16 83.03,97.94 30.48,97.94 30.43,98 30.43,98.05 30.09,98.39 29.6,98.39 29.36,98.15 15.73,98.15 13.69,96.11 13.69,83.46 IC8.5
!DTACK  (via drill 0.35)
  Top 0.203: v29.84,97.81 v29.84,73.66 | LED6.C 76.2,98.27 IC1.31
  Bottom 0.203: IC1.31 76.2,96.52 75.13,97.59 30.07,97.59 v29.84,97.81 | v29.84,73.66 29.84,62.87 31.75,60.96 42.55,60.96 43.18,60.33 IC7.2
!HALT  (via drill 0.35)
  Top 0.203: IC1.36 63.5,92.71 64.77,91.44 66.67,91.44 67.31,90.81 R17.1 67.09,90.17 v66.04,90.17 | v22.23,33.02 v25.4,36.2 | v26.04,37.47 26.04,42.55 v29.84,46.35 | v36.83,47.62 v36.83,53.34 | v36.83,60.33 36.83,61.59 v40.64,65.41 | v41.27,75.56 41.27,76.2 41.91,76.83 41.91,89.53 v42.55,90.17 | LED2.C 16.51,29.84 17.14,29.21 IC13.4
  Bottom 0.203: IC13.4 17.14,29.21 20.95,33.02 v22.23,33.02 | v25.4,36.2 26.04,36.83 v26.04,37.47 | v29.84,46.35 31.88,46.35 32.24,46.71 35.92,46.71 v36.83,47.62 | v36.83,53.34 v36.83,60.33 | v40.64,65.41 41.27,66.04 v41.27,75.56 | v42.55,90.17 43.38,91.01 65.2,91.01 v66.04,90.17
!IPL1  (via drill 0.35)
  Top 0.203: IC5.24 41,24.49 41,25.78 41.89,26.67 49.53,26.67 50.8,27.94 v50.8,50.16 | v51.39,53.34 51.44,53.39 51.44,74.3 49.53,76.2 49.53,83.82 50.8,85.09 IC1.41
  Bottom 0.203: v50.8,50.16 50.8,52.75 v51.39,53.34
!NIXIE_CS  (via drill 0.35)
  Top 0.203: IC6.6 13.34,57.15 v13.34,55.88 | v20.95,53.34 20.95,39.37 v22.23,38.1 | v27.94,4.45 52.07,4.45 54.61,1.91 64.04,1.91 v64.14,1.81
  Bottom 0.203: IC8.11 12.06,72.44 12.98,71.52 12.98,61.83 12.06,60.91 IC6.6 | v13.34,55.88 13.34,54.61 13.97,53.98 18.41,53.98 19.05,53.34 v20.95,53.34 | v22.23,38.1 27.3,33.02 27.3,5.71 27.94,5.08 v27.94,4.45 | SV1.17 72.39,7.62 72.39,1.91 71.75,1.27 64.67,1.27 v64.14,1.81
!OE  (via drill 0.35)
  Top 0.203: v45.09,54.61 50.63,54.61 v50.8,54.44 | v53.98,53.98 54.61,53.34 54.61,50.16 55.24,49.53 73.03,49.53 73.66,50.16 IC2.24
  Bottom 0.203: IC3.24 73.66,60.37 74.57,59.46 74.57,57.38 73.66,56.47 IC2.24 73.66,50.62 74.57,49.7 74.57,35.79 73.66,34.88 IC4.22 | IC7.4 41.91,54.61 v45.09,54.61 | v50.8,54.44 53.51,54.44 v53.98,53.98
!RAM_CS  (via drill 0.35)
  Top 0.203: IC9.4 17.14,66.04 | 17.14,66.04 17.14,64.82 18.06,63.9 18.06,61.83 17.14,60.91 IC6.4 | 17.14,66.04 17.78,66.04 v18.41,66.67 | v20.32,66.67 50.63,66.67 v50.8,66.5 | v60.33,66.5 73.2,66.5 77.47,62.23 77.47,56.52 78.74,55.24 IC2.22
  Bottom 0.203: v18.41,66.67 v20.32,66.67 | v50.8,66.5 v60.33,66.5 | IC6.4 17.14,56.3 R3.1
!RAM_CS0
  Top 0.203: IC8.9 8.89,73.03 11.43,73.03 12.06,72.39 IC9.6
!RAM_CS1
  Top 0.203: IC8.7 10.79,81.28 10.79,73.66 11.07,73.38 11.58,73.38 12.98,71.98 12.98,71.48 13.97,70.48 IC9.5
!RESET  (via drill 0.35)
  Top 0.203: IC5.38 45.7,35.56 47.09,34.17 49.76,34.17 50.11,34.53 50.11,48.22 v48.16,50.16 | v48.16,71.12 50.16,73.12 50.16,75.06 49.17,76.05 49.17,83.97 50.16,84.96 v50.16,92.71 | v33.66,30.48 33.66,28.55 32.13,27.03 32.08,27.03 30.84,25.78 30.84,25.73 29.59,24.49 29.57,24.49 27.94,22.86 24.77,22.86 23.5,24.13 | IC13.2 22.23,25.4 23.5,24.13 | IC1.37 60.96,93.34 63.92,90.39 R4.1 | LED1.C 16.63,30.2 16.66,30.2 18.41,28.44 18.41,24.77 19.05,24.13 20.32,24.13 20.95,24.13 23.5,24.13
  Bottom 0.203: v48.16,50.16 v48.16,71.12 | v50.16,92.71 50.49,93.04 51.18,93.04 52.07,93.93 52.07,95.89 52.7,96.52 60.33,96.52 60.96,95.89 IC1.37 | v33.66,30.48 38.73,35.56 IC5.38
!ROM_CS  (via drill 0.35)
  Top 0.203: IC9.3 19.68,67.31 | 19.68,67.31 19.68,64.82 20.6,63.9 20.6,61.83 19.68,60.91 IC6.3 | IC3.22 78.74,73.03 72.57,66.86 60.79,66.86 60.57,67.08 60.55,67.08 v60.33,67.31 | v50.8,67.31 50.57,67.08 50.56,67.08 50.51,67.03 20.79,67.03 20.56,67.26 19.74,67.26 19.68,67.31
  Bottom 0.203: v60.33,67.31 v50.8,67.31 | IC6.3 19.68,56.09 R2.1
!ROM_CS0
  Top 0.203: IC8.15 24.77,72.39 IC9.1
!ROM_CS1
  Top 0.203: IC8.14 22.23,72.39 IC9.2
!RTC_CS  (via drill 0.35)
  Top 0.203: IC8.12 14.61,72.44 15.52,71.52 15.52,65.41 | IC6.5 14.61,60.91 15.52,61.83 15.52,65.41 | 15.52,65.41 v16.51,65.41 | v20.32,65.87 20.55,66.09 20.56,66.09 20.79,66.32 50.18,66.32 50.22,66.28 50.22,66.26 50.56,65.92 50.57,65.92 v50.8,65.7 | IC4.20 78.74,31.75 79.38,32.38 80.64,32.38 82.55,34.29 82.55,38.73 74.93,46.35 74.93,64.14 73.66,65.41 73.37,65.7 73.03,66.04 60.68,66.04 60.57,65.92 60.55,65.92 v60.33,65.7
  Bottom 0.203: v16.51,65.41 19.86,65.41 v20.32,65.87 | v50.8,65.7 v60.33,65.7
!VFD_CS  (via drill 0.35)
  Top 0.203: v17.14,52.96 IC6.11 17.14,46.99 18.41,45.72 v18.41,43.18 | v50.8,3.86 v27.3,3.86
  Bottom 0.203: IC8.10 9.53,72.44 10.44,71.52 10.44,56.24 13.72,52.96 v17.14,52.96 | SV2.5 v50.8,3.86 | v27.3,3.86 27.3,5.13 26.95,5.48 26.95,32.87 22.3,37.52 21.98,37.52 21.59,37.91 21.59,40.01 v18.41,43.18
!VFD_RESET
  Bottom 0.203: SV2.4 48.26,21.59 IC5.30
+5V  (via drill 0.35)
  Top 0.203: 53.34,48.58 C2.1 53.66,47.94 54.61,46.99 v56.52,46.99 | 53.34,70.17 C1.1 | IC4.28 58.42,26.99 C3.1 55.24,26.67 | 32.41,72.39 Q1.8 | 32.41,72.39 C6.1 | IC1.40 IC1.39 55.88,99.06 | 28.57,72.39 32.41,72.39 | IC8.6 12.06,83.82 11.43,84.45 3.81,84.45 | 52.07,50.8 IC7.14 C17.1 | IC6.2 IC6.1 | IC5.44 32.38,47.62 26.67,47.62 | IC6.14 24.77,48.9 26.04,47.62 26.67,47.62 | 26.67,47.62 26.67,46.67 C7.1 26.35,43.49 24.77,41.91 R1.2 | C15.1 25.08,74.61 IC8.16 | C13.1 25.09,87.31 IC12.14 | C16.1 27.62,62.87 IC9.14 | v12.06,55.88 12.06,53.98 | SV6.6 10.16,42.55 3.81,42.55 | 63.5,88.9 63.72,88.69 R4.2 R17.2 70.27,88.69 71.12,89.53 71.12,91.44 | 61.91,84.45 C5.1 | IC1.33 71.12,91.44 | v24.77,3.81 24.13,3.17 R18.1 | IC13.14 24.77,17.78 24.13,17.14 v17.78,17.14 17.14,16.51 IC11.4 | R13.1 5.29,69.22 3.81,69.22 | R19.1 R20.1 3.81,29.84 | R21.1 83.24,97.63 83.24,97.57 82.19,96.52 78.11,96.52 77.47,95.89 77.47,92.08 76.83,91.44 71.12,91.44 | C20.1 24.45,6.67 IC11.8
  Top 0.406: 53.34,48.58 IC2.32 52.07,52.07 | 53.34,70.17 IC3.32 52.7,73.66 52.07,73.03 52.07,63.5 | 52.07,52.07 52.07,50.8 52.07,33.02 55.24,29.84 55.24,26.67 55.24,14.61 56.52,13.34 59.69,13.34 62.87,10.16 v64.77,10.16 | 52.07,63.5 52.07,52.07 | IC9.14 IC6.1 24.77,53.98 | 24.77,53.98 IC6.14 | v28.57,71.12 28.57,72.39 27.3,72.39 IC8.16 24.77,80.45 25.78,81.47 25.78,83.63 24.77,84.65 IC12.14 24.77,88.9 23.5,90.17 23.5,99.06 55.88,99.06 56.52,99.06 57.78,97.79 | 63.5,84.45 63.5,88.9 63.5,89.53 59.69,93.34 59.69,95.89 57.78,97.79 | 63.5,84.45 IC1.13 | C10.+ 52.07,63.5 | 24.77,53.98 21.29,53.98 21.24,54.02 20.67,54.02 20.62,53.98 12.06,53.98 3.81,53.98 | C14.+ 3.81,47.62 | 63.5,84.45 61.91,84.45 | C8.+ 57.78,97.79
  Top 0.508: 23.5,99.06 3.81,99.06 3.81,84.45 3.81,69.22 3.81,53.98 3.81,47.62 3.81,42.55 3.81,29.84 v3.81,27.94
  Bottom 0.203: C11.1 SV5.8 | 42.55,3.17 42.55,1.91 C9.1 | IC2.30 58.42,50.16 56.52,48.26 v56.52,46.99 | R2.2 22.23,56.94 IC6.2 | R3.2 14.39,56.52 12.7,56.52 v12.06,55.88 | C28.1 11.75,40.95 SV6.6 | C12.1 IC13.14 | IC11.8 v24.77,3.81 24.77,3.17 | R16.1 17.57,13.55 IC11.4 | v17.78,17.14 5.71,17.14
  Bottom 0.406: SV5.6 SV5.8 42.55,8.89 | 42.55,8.89 SV2.2 | SV1.19 67.31,7.62 | 42.55,3.17 C4.+ 65.81,6.12 67.31,7.62 | 42.55,3.17 24.77,3.17 8.89,3.17 5.71,6.35 | 42.55,8.89 42.55,3.17 | v64.77,10.16 67.31,7.62 | IC9.14 27.3,62.87 28.57,64.14 v28.57,71.12
  Bottom 0.508: 5.71,25.72 4.17,25.72 C24.+ v3.81,27.94 | 5.71,25.72 C25.1 | C21.1 3.49,6.35 5.71,6.35 SV3.1 SV3.3 SV3.5 5.71,17.14 5.71,25.72
A0  (via drill 0.35)
  Top 0.203: IC2.12 78.03,33.58 56.22,33.58 56.17,33.63 v55.85,33.63 | IC5.2 38.46,39.01 42.29,39.01 42.82,38.48 42.82,38.46 43.54,37.74 43.54,37.72 44.07,37.19 47.9,37.19 v49.53,35.56
  Bottom 0.203: SV1.3 86.36,11.43 83.82,11.43 81.28,13.97 IC4.10 81.28,28.53 80.37,29.44 80.37,34.47 81.28,35.38 IC2.12 81.28,50.12 80.37,51.03 80.37,56.05 81.28,56.97 IC3.12 80.01,59.69 80.01,91.44 79.38,92.08 38.73,92.08 38.1,92.71 IC1.46 | v49.53,35.56 51.46,33.63 v55.85,33.63
A1  (via drill 0.35)
  Top 0.203: IC2.11 75.84,33.93 56.37,33.93 56.09,34.21 55.61,34.21 55.27,33.87 55.27,33.68 55.24,33.66 v55.24,33.02 | IC5.4 35.54,40.64 36.45,39.73 37.24,39.73 38.46,38.51 38.46,37.72 39.35,36.83 47.44,36.83 v49.52,34.75
  Bottom 0.203: SV1.5 85.09,10.16 83.82,10.16 IC4.9 78.74,28.53 77.83,29.44 77.83,31.52 78.74,32.43 IC2.11 78.74,50.12 77.83,51.03 77.83,53.11 78.74,54.02 IC3.11 78.74,60.33 77.47,61.59 77.47,90.81 76.56,91.72 38.46,91.72 IC1.47 | v49.52,34.75 49.83,34.75 51.31,33.27 54.99,33.27 v55.24,33.02
A2  (via drill 0.35)
  Top 0.203: IC2.10 73.66,34.29 56.52,34.29 56.24,34.56 55.46,34.56 54.66,33.76 54.66,32.92 v54.44,32.69 | IC5.6 33.02,39.37 37.09,39.37 38.1,38.36 38.1,32.38 38.73,31.75 v50.16,31.75
  Bottom 0.203: SV1.7 82.55,10.16 81.28,10.16 IC4.8 76.2,28.53 75.29,29.44 75.29,34.47 76.2,35.38 IC2.10 76.2,50.12 75.29,51.03 75.29,56.05 76.2,56.97 IC3.10 76.2,59.05 74.93,60.33 74.93,90.81 74.37,91.36 36.27,91.36 IC1.48 | v50.16,31.75 53.5,31.75 v54.44,32.69
A3  (via drill 0.35)
  Top 0.203: v54.61,43.13 72.97,43.13 v73.03,43.18 | v29.21,43.18 IC5.7
  Bottom 0.203: IC3.9 73.66,56.97 72.75,56.05 72.75,51.03 73.66,50.12 73.66,43.18 | 73.66,43.18 IC2.9 73.66,35.38 72.75,34.47 72.75,29.44 73.66,28.53 IC4.7 78.74,10.16 80.01,10.16 SV1.9 | IC1.1 35.99,76.4 43.95,76.4 48.74,71.61 48.74,46.4 | 48.74,46.4 52.02,43.13 v54.61,43.13 | v73.03,43.18 73.66,43.18 | v29.21,43.18 32.38,46.35 48.7,46.35 48.74,46.4
A4  (via drill 0.35)
  Top 0.203: v54.61,43.93 69.97,43.93 v70.48,44.45
  Bottom 0.203: IC3.8 71.12,56.97 70.21,56.05 70.21,51.03 71.12,50.12 71.12,44.45 | 71.12,44.45 IC2.8 71.12,35.38 70.21,34.47 70.21,29.44 71.12,28.53 IC4.6 76.2,10.16 77.47,10.16 SV1.11 | IC1.2 38.18,76.76 44.09,76.76 49.1,71.75 49.1,46.55 51.71,43.93 v54.61,43.93 | v70.48,44.45 71.12,44.45
A5  (via drill 0.35)
  Top 0.203: v54.61,44.74 67.6,44.74 v67.94,45.09
  Bottom 0.203: IC3.7 68.58,56.97 67.67,56.05 67.67,51.03 68.58,50.12 68.58,45.09 | 68.58,45.09 IC2.7 68.58,35.38 67.67,34.47 67.67,29.44 68.58,28.53 IC4.5 | IC1.3 40.36,77.11 44.3,77.11 49.45,71.96 49.45,46.7 51.41,44.74 v54.61,44.74 | v67.94,45.09 68.58,45.09
A6  (via drill 0.35)
  Top 0.203: v65.41,45.72 65.23,45.55 v54.61,45.55
  Bottom 0.203: IC3.6 66.04,56.97 65.13,56.05 65.13,51.03 66.04,50.12 66.04,45.72 | 66.04,45.72 IC2.6 66.04,35.38 65.13,34.47 65.13,29.44 66.04,28.53 IC4.4 | IC1.4 42.55,77.47 44.45,77.47 49.81,72.11 49.81,46.84 51.1,45.55 v54.61,45.55 | v65.41,45.72 66.04,45.72
A7  (via drill 0.35)
  Top 0.203: v54.61,46.35 54.84,46.13 54.85,46.13 55.08,45.9 62.41,45.9 v62.87,46.35
  Bottom 0.203: IC3.5 63.5,56.97 62.59,56.05 62.59,51.03 63.5,50.12 63.5,46.35 | 63.5,46.35 IC2.5 63.5,35.38 62.59,34.47 62.59,29.44 63.5,28.53 IC4.3 | v62.87,46.35 63.5,46.35 | IC1.5 50.16,72.39 50.16,46.99 50.8,46.35 v54.61,46.35
A8  (via drill 0.35)
  Top 0.203: v60.18,75.9 65.71,75.9 66.04,75.56 IC3.27
  Bottom 0.203: IC3.27 66.04,60.37 66.95,59.46 66.95,57.38 66.04,56.47 IC2.27 66.04,50.62 66.95,49.7 66.95,35.79 66.04,34.88 IC4.25 | IC1.6 47.62,77.47 48.39,77.47 49.38,76.48 58.78,76.48 59.36,75.9 v60.18,75.9
A9  (via drill 0.35)
  Top 0.203: IC3.26 68.58,75.56 67.67,76.48 59.73,76.48 v59.53,76.68
  Bottom 0.203: IC3.26 68.58,60.37 69.49,59.46 69.49,57.38 68.58,56.47 IC2.26 68.58,50.62 69.49,49.7 69.49,35.79 68.58,34.88 IC4.24 | IC1.7 48.26,78.11 49.53,76.83 59.38,76.83 v59.53,76.68
A10
  Top 0.203: IC3.23 72.67,77.19 61.19,77.19 59.69,78.69 59.69,80.56 58.95,81.31 55.35,81.31 55.33,81.28 52.07,81.28 50.8,80.01 IC1.8
  Bottom 0.203: IC3.23 76.2,60.37 77.11,59.46 77.11,57.38 76.2,56.47 IC2.23 76.2,50.62 77.11,49.7 77.11,35.79 76.2,34.88 IC4.21
A11
  Top 0.203: IC1.9 53.93,79.38 55.5,80.95 58.8,80.95 59.33,80.41 59.33,78.34 60.84,76.83 70.48,76.83 71.12,76.2 IC3.25
  Bottom 0.203: IC3.25 71.12,60.37 72.03,59.46 72.03,57.38 71.12,56.47 IC2.25 71.12,50.62 72.03,49.7 72.03,35.79 71.12,34.88 IC4.23
A12
  Top 0.203: IC3.4 59.69,59.69 59.69,75.56 IC1.10
  Bottom 0.203: IC3.4 60.96,54.02 60.05,53.11 60.05,51.03 60.96,50.12 IC2.4 60.96,35.38 60.05,34.47 60.05,29.44 60.96,28.53 IC4.2
A13
  Bottom 0.203: IC4.26 63.5,34.88 64.41,35.79 64.41,49.7 63.5,50.62 IC2.28 63.5,56.47 64.41,57.38 64.41,59.46 63.5,60.37 IC3.28 63.5,74.3 61.87,75.92 61.87,80.41 61.34,80.95 60.58,80.95 59.01,79.38 IC1.11
A14
  Bottom 0.203: IC4.1 58.42,28.53 59.33,29.44 59.33,31.52 58.42,32.43 IC2.3 58.42,39.37 59.69,40.64 59.69,60.33 60.96,61.59 IC3.29 IC1.12
A15  (via drill 0.35)
  Top 0.203: v64.14,60.96 63.17,59.99 63.12,59.99 62.23,59.1 62.23,56.52 61.59,55.88 59.05,55.88 58.42,56.52 IC3.3
  Bottom 0.203: IC3.3 58.42,57.15 55.88,54.61 IC2.31 | IC1.14 64.77,78.11 64.77,61.59 v64.14,60.96
A16  (via drill 0.35)
  Top 0.203: v67.31,62.87 v60.33,62.87
  Bottom 0.203: IC2.2 55.88,50.12 54.97,51.03 54.97,54.2 55.88,55.11 IC3.2 55.88,60.33 58.42,62.87 v60.33,62.87 | IC8.1 69.85,82.55 71.12,81.28 IC1.16 67.31,75.56 v67.31,62.87
A17
  Bottom 0.203: IC8.2 22.23,83.82 22.86,84.45 26.67,84.45 28.22,82.91 71.4,82.91 73.66,80.64 IC1.17
A18  (via drill 0.35)
  Top 0.203: v73.66,81.92 IC1.18
  Bottom 0.203: IC8.3 20.27,82.55 22.53,84.81 26.95,84.81 28.5,83.26 72.31,83.26 v73.66,81.92
CLK  (via drill 0.35)
  Top 0.203: Q1.5 46.99,74.93 v46.99,81.28 | v57.15,92.71 57.15,83.82 55.24,81.92 v50.16,81.92 | v48.26,44.45 48.26,47.53 v48.16,47.62
  Bottom 0.203: v57.15,92.71 67.94,92.71 68.58,93.34 IC1.34 | v50.16,81.92 48.9,81.92 48.26,81.28 v46.99,81.28 | IC5.36 45.72,34.29 47.62,34.29 48.26,34.92 v48.26,44.45 | v48.16,47.62 46.89,48.9 46.89,71.85 46.35,72.39 Q1.5
D0  (via drill 0.35)
  Top 0.203: IC4.11 83.82,10.33 84.84,9.31 84.84,8.47 83.82,7.45 SV1.8 82.72,6.35 79.47,3.1 55.66,3.1 53.34,5.42 SV2.7 | IC5.28 45.09,22.23 v45.09,13 | IC1.27 R5.2
  Bottom 0.203: IC4.11 83.82,28.53 82.91,29.44 82.91,34.47 83.82,35.38 IC2.13 83.82,50.12 82.91,51.03 82.91,56.05 83.82,56.97 IC3.13 83.46,58.78 83.46,72.06 82.91,72.62 82.91,74.7 83.46,75.26 83.46,77.78 82.91,78.34 82.91,80.41 82.93,80.44 82.93,81.04 86.36,84.47 IC1.27 | v45.09,13 45.09,11.43 47.24,9.27 47.24,8.47 48.35,7.37 51.22,7.37 52.24,6.35 SV2.7
D1  (via drill 0.35)
  Top 0.203: IC4.12 86.36,10.33 87.38,9.31 87.38,8.47 86.36,7.45 SV1.6 85.26,6.35 81.65,2.74 55.51,2.74 52.32,5.93 52.32,6.77 53.34,7.79 SV2.8 | IC5.18 33.93,20.68 33.93,16.36 39.22,11.07 53.06,11.07 v53.34,10.79 | R6.2 IC1.26
  Bottom 0.203: IC4.12 86.36,28.53 85.45,29.44 85.45,34.47 86.36,35.38 IC2.14 86.36,50.12 85.45,51.03 85.45,56.05 86.36,56.97 IC3.14 86,58.78 86,72.06 85.45,72.62 85.45,74.7 86,75.26 86,77.78 85.45,78.34 85.45,80.41 85.47,80.44 85.47,81.04 88.9,84.47 IC1.26 | v53.34,10.79 SV2.8
D2  (via drill 0.35)
  Top 0.203: IC4.13 88.9,10.33 89.92,9.31 89.92,8.47 88.9,7.45 SV1.4 87.8,6.35 83.83,2.39 55.36,2.39 51.97,5.78 51.97,6.92 51.99,6.94 51.99,8.97 52.92,9.91 | 52.92,9.91 53.76,9.91 54.36,9.31 54.36,7.87 SV2.9 | IC5.27 43.18,24.13 v43.18,13 | v43.18,10.49 52.33,10.49 52.92,9.91 | R9.2 IC1.25
  Bottom 0.203: IC4.13 88.9,28.53 87.99,29.44 87.99,34.47 88.9,35.38 IC2.15 88.9,50.12 87.99,51.03 87.99,56.05 88.9,56.97 IC3.15 88.54,58.78 88.54,72.06 87.99,72.62 87.99,74.7 88.54,75.26 88.54,77.78 87.99,78.34 87.99,80.41 88.01,80.44 88.01,81.04 91.44,84.47 IC1.25 | v43.18,13 v43.18,10.49
D3  (via drill 0.35)
  Top 0.203: IC4.15 91.44,27.94 90.17,26.67 82.55,26.67 80.01,24.13 80.01,7.62 SV1.10 80.51,6.35 77.62,3.45 59.54,3.45 57.4,5.59 57.4,7.37 SV2.10 | IC5.19 33,25.4 33.91,26.31 34.67,26.31 35.56,25.42 35.56,16.51 39.93,12.14 48.67,12.14 v48.9,12.37 | R10.2 IC1.24
  Bottom 0.203: IC4.15 91.44,34.88 92.35,35.79 92.35,37.87 91.44,38.78 IC2.17 91.44,56.47 92.35,57.38 92.35,59.46 91.44,60.37 IC3.17 IC1.24 | v48.9,12.37 54.94,12.37 55.88,11.43 SV2.10
D4  (via drill 0.35)
  Top 0.203: IC4.16 88.9,27.94 87.99,27.03 82.4,27.03 77.47,22.09 77.47,7.62 SV1.12 78.74,5.08 77.47,3.81 59.69,3.81 58.42,5.08 SV2.11 | v47.62,13.34 v48.9,13.34 | R11.2 IC1.23
  Bottom 0.203: IC4.16 88.9,34.88 89.81,35.79 89.81,49.7 88.9,50.62 IC2.18 88.9,56.47 89.81,57.38 89.81,59.46 88.9,60.37 IC3.18 IC1.23 | IC5.26 41.91,17.5 46.08,13.34 v47.62,13.34 | v48.9,13.34 49.51,12.72 55.09,12.72 56.9,10.92 56.9,8.51 58.42,6.99 SV2.11
D5
  Top 0.203: IC4.17 86.36,29.21 84.53,27.38 82.25,27.38 74.93,20.06 74.93,7.62 SV1.14 76.2,5.44 74.93,4.17 60.6,4.17 59.69,5.08 59.69,7.62 SV2.12 58.42,10.79 57.78,11.43 39.37,11.43 34.29,16.51 IC5.20 | R12.2 IC1.22
  Bottom 0.203: IC4.17 86.36,34.88 87.27,35.79 87.27,49.7 86.36,50.62 IC2.19 86.36,56.47 87.27,57.38 87.27,59.46 86.36,60.37 IC3.19 IC1.22
D6  (via drill 0.35)
  Top 0.203: IC4.18 82.55,29.21 82.55,28.18 72.39,18.02 72.39,7.62 SV1.16 73.66,5.08 73.1,4.52 62.79,4.52 SV2.13 | v47.62,14.14 v48.9,14.14 | R14.2 IC1.21
  Bottom 0.203: IC4.18 83.82,34.88 84.73,35.79 84.73,49.7 83.82,50.62 IC2.20 83.82,56.47 84.73,57.38 84.73,59.46 83.82,60.37 IC3.20 IC1.21 | IC5.25 41,23.77 42.29,23.77 42.82,23.24 42.82,17.09 45.77,14.14 v47.62,14.14 | v48.9,14.14 49.12,13.92 49.14,13.92 49.97,13.08 55.67,13.08 59.44,9.31 59.44,7.87 SV2.13
D7
  Top 0.203: IC4.19 81.28,27.41 69.85,15.98 69.85,11.43 | SV1.18 69.85,7.62 69.85,11.43 | 69.85,11.43 67.31,11.43 64.77,8.89 SV2.14 60.96,10.79 59.97,11.79 39.65,11.79 34.92,16.51 34.92,22.2 35.2,22.48 35.2,24.49 IC5.21 | R15.2 IC1.20
  Bottom 0.203: IC4.19 81.28,34.88 82.19,35.79 82.19,49.7 81.28,50.62 IC2.21 81.28,56.47 82.19,57.38 82.19,59.46 81.28,60.37 IC3.21 IC1.20
FC0
  Bottom 0.203: IC12.1 24.77,95.89 25.4,96.52 40.01,96.52 40.64,95.89 IC1.45
FC1
  Bottom 0.203: IC1.44 40.92,96.88 17.5,96.88 17.14,96.52 IC12.4
FC2
  Bottom 0.203: IC1.43 43.1,97.23 15.32,97.23 14.61,96.52 IC12.5
GND  (via drill 0.35)
  other vias: 76.2,90.81 76.2,76.83 77.47,55.24 77.47,34.29 77.47,26.04 74.93,26.04 72.39,26.04 69.85,26.04 67.31,26.04 64.77,26.04 59.69,24.77 80.01,49.53 80.01,39.37 78.74,71.12 78.74,62.23 78.74,82.55 40.64,34.29 47.52,53.34 43.18,53.34 47.88,48.9 46.99,44.45 50.16,33.02 41.91,14.61 40.01,19.05 40.64,29.21 35.56,29.21 35.56,34.29 59.69,21.59 58.42,64.14 55.24,68.58 59.69,86.36 69.22,90.68 57.68,48.26 57.68,69.85 62.87,26.04 56.52,27.94 56.52,25.4 73.03,90.68 73.03,84.33 68.58,86.87 71.12,11.43 76.2,11.43 78.74,11.43 81.28,11.43 83.95,3.81 81.41,3.81 79.12,3.81 73.41,10.79 77.22,4.45 55.63,4.45 57.53,4.45 38.73,30.48 42.55,30.48 50.16,30.48 51.44,30.48 28.57,90.81 27.94,78.11 32.38,76.2 27.94,59.69 22.86,46.35 12.06,6.35 10.16,34.29 16.51,37.47 10.16,36.2 26.67,35.56 90.17,91.44 87.63,91.44 87.63,85.09 90.17,85.09 90.17,76.83 90.17,60.96 90.17,33.02 90.17,27.94 87.63,17.78 85.09,17.78 82.55,17.78 82.55,25.4 85.09,25.4 87.63,25.4 90.17,25.4 80.01,42.55 75.56,44.45 75.56,39.37 57.15,38.73 57.15,41.91 69.85,62.87 72.39,62.87 72.39,71.12 69.85,71.12 82.55,71.12 85.09,71.12 87.63,71.12 90.17,71.12 87.63,60.96 85.09,60.96 82.55,60.96 62.23,71.12 38.1,15.88 76.2,84.45 90.17,87 87.63,87 92.71,87 48.9,37.47
  pour Top: 0,0 0,100 96.83,100 96.83,0
  pour Bottom: 0,0 0,100 96.83,100 96.83,0
N$1
  Bottom 0.203: IC11.2 22.23,11.74 C18.1 R16.2 19.27,10.38 19.05,10.16 9.8,10.16 | S2.2 9.8,10.16 | 9.8,10.16 S2.1
N$2
  Top 0.203: R19.2 9.74,31.75 LED1.A
N$3
  Bottom 0.203: IC6.8 11.1,52.38 44.76,52.38 45.72,53.34 IC7.1
N$4
  Top 0.203: R13.2 LED5.A
N$5  (via drill 0.35)
  Top 0.203: IC12.3 19.68,88.9 19.36,88.57 19.31,88.57 18.77,88.03 18.77,69.45 19.03,69.19 19.03,64.16 18.77,63.9 18.77,57.38 19.31,56.84 19.36,56.84 19.68,56.52 v23.5,56.52
  Bottom 0.203: v23.5,56.52 34.92,56.52 35.56,57.15 IC7.5
N$6
  Top 0.203: R20.2 LED2.A
N$7
  Top 0.203: R7.2 LED3.A
N$9
  Top 0.203: LED4.A 17.57,34.29 R8.2
N$10
  Top 0.203: LED6.A R21.2
N$11
  Top 0.203: IC12.6 12.06,95.89 12.7,96.52 21.59,96.52 22.23,95.89 IC12.2
N$12
  Top 0.203: C19.1 R18.2 22.23,3.39 IC11.7 IC11.6
OUT0  (via drill 0.35)
  Top 0.203: SV6.8 8.89,40.01 10.79,38.1 19.68,38.1 20.59,37.2 20.66,37.2 20.8,37.05 20.8,36.98 v22.86,34.92 | v26.37,29.57 28,27.94 IC5.15
  Bottom 0.203: v22.86,34.92 22.86,33.08 v26.37,29.57
OUT1  (via drill 0.35)
  Top 0.203: IC5.14 30.48,29.21 27.3,29.21 26.95,29.57 26.95,29.81 v26.37,30.39 | v23.47,35.53 23.44,35.56 22.8,35.56 19.9,38.46 11.07,38.46 10.16,39.37 v10.16,40.01
  Bottom 0.203: v26.37,30.39 26.13,30.39 23.47,33.05 v23.47,35.53 | v10.16,40.01 10.16,43.18 9.53,43.81 SV6.7
R/!W!  (via drill 0.35)
  Top 0.203: 57.15,55.24 58.42,53.98 59.69,53.98 60.96,52.7 IC2.29 | IC7.3 40.64,56.52 41.91,55.24 v50.8,55.24 | v54.61,55.24 57.15,55.24 | v54.61,78.11 54.61,77.47 55.88,76.2 IC3.31 55.88,71.29 56.46,70.7 56.46,68.63 59.05,66.04 59.05,61.59 57.15,59.69 57.15,55.24 | IC5.9 30.84,33.93 32.13,33.93 36.85,29.21 v37.47,29.21 | v38.73,29.21 39.82,29.21 40.4,29.79 40.88,29.79 41.46,29.21 v50.16,29.21 | v57.15,23.5 v61.87,23.5 | v64.77,81.92 72.39,81.92 73.66,83.19 78.11,83.19 78.74,83.82 IC1.30
  Bottom 0.203: IC2.29 60.96,50.62 61.87,49.7 61.87,35.79 60.96,34.88 IC4.27 60.96,29.03 61.87,28.11 v61.87,23.5 61.87,14.33 63.5,12.7 72.39,12.7 SV1.13 | v50.8,55.24 v54.61,55.24 | v64.77,81.92 55.24,81.92 54.61,81.28 v54.61,78.11 | v37.47,29.21 v38.73,29.21 | v50.16,29.21 55.88,23.5 v57.15,23.5
RESET
  Top 0.203: IC13.3 19.68,27.94 20.32,28.57 24.13,28.57 24.77,27.94 IC13.1
  Bottom 0.203: IC11.3 20.95,15.24 20.95,22.86 19.68,24.13 IC13.3
STATUS0
  Top 0.203: IC5.17 22.86,31.75 20.95,31.75 19.9,32.8 R8.1
STATUS1
  Top 0.203: IC5.16 30.84,27.03 28.09,27.03 23.01,32.11 21.23,32.11 20.95,32.38 20.95,35.14 R7.1
SW0
  Bottom 0.203: IC5.5 33.04,38.1 32.13,39.01 26.89,39.01 21.1,44.81 17.5,44.81 SV6.1
SW1
  Bottom 0.203: IC5.8 30.48,36.83 28.57,36.83 20.95,44.45 18.41,44.45 17.78,43.81 17.78,42.55 SV6.2
SW2
  Bottom 0.203: IC5.40 43.2,40.64 42.29,39.73 26.68,39.73 21.25,45.16 15.32,45.16 SV6.3
UART0_RX
  Bottom 0.203: IC5.35 46.99,32.48 45.36,30.86 45.36,27.56 44.83,27.03 33.38,27.03 32.66,26.31 32.66,10.52 SV5.4
UART0_TX
  Bottom 0.203: IC5.33 45.72,29.21 45.72,27.41 44.98,26.67 33.66,26.67 33.02,26.04 33.02,11.6 35.31,9.31 35.31,7.24 34.42,6.35 SV5.3
UART1_RX
  Bottom 0.203: IC5.11 29.21,31.77 30.84,30.15 30.84,9.8 SV5.2
UART1_TX
  Bottom 0.203: IC5.13 30.48,29.21 30.48,6.99 31.11,6.35 SV5.1
VFD_BUSY  (via drill 0.35)
  Top 0.203: IC5.3 37.74,37.19 37.74,32.24 38.1,31.88 38.1,17.14 v41.91,13 | SV2.3 46.99,7.62 44.45,7.62 41.91,10.16 v41.91,10.49
  Bottom 0.203: v41.91,13 v41.91,10.49

### Text on the board
tNames: 68k Nixie Clock / Rev 01 | ↯Place 68k strain here↯ | UARTs | VFD | Nixie Drivers